# EAGLE design BE200_QUAD_Rev1 (EAGLE 6.5.0)
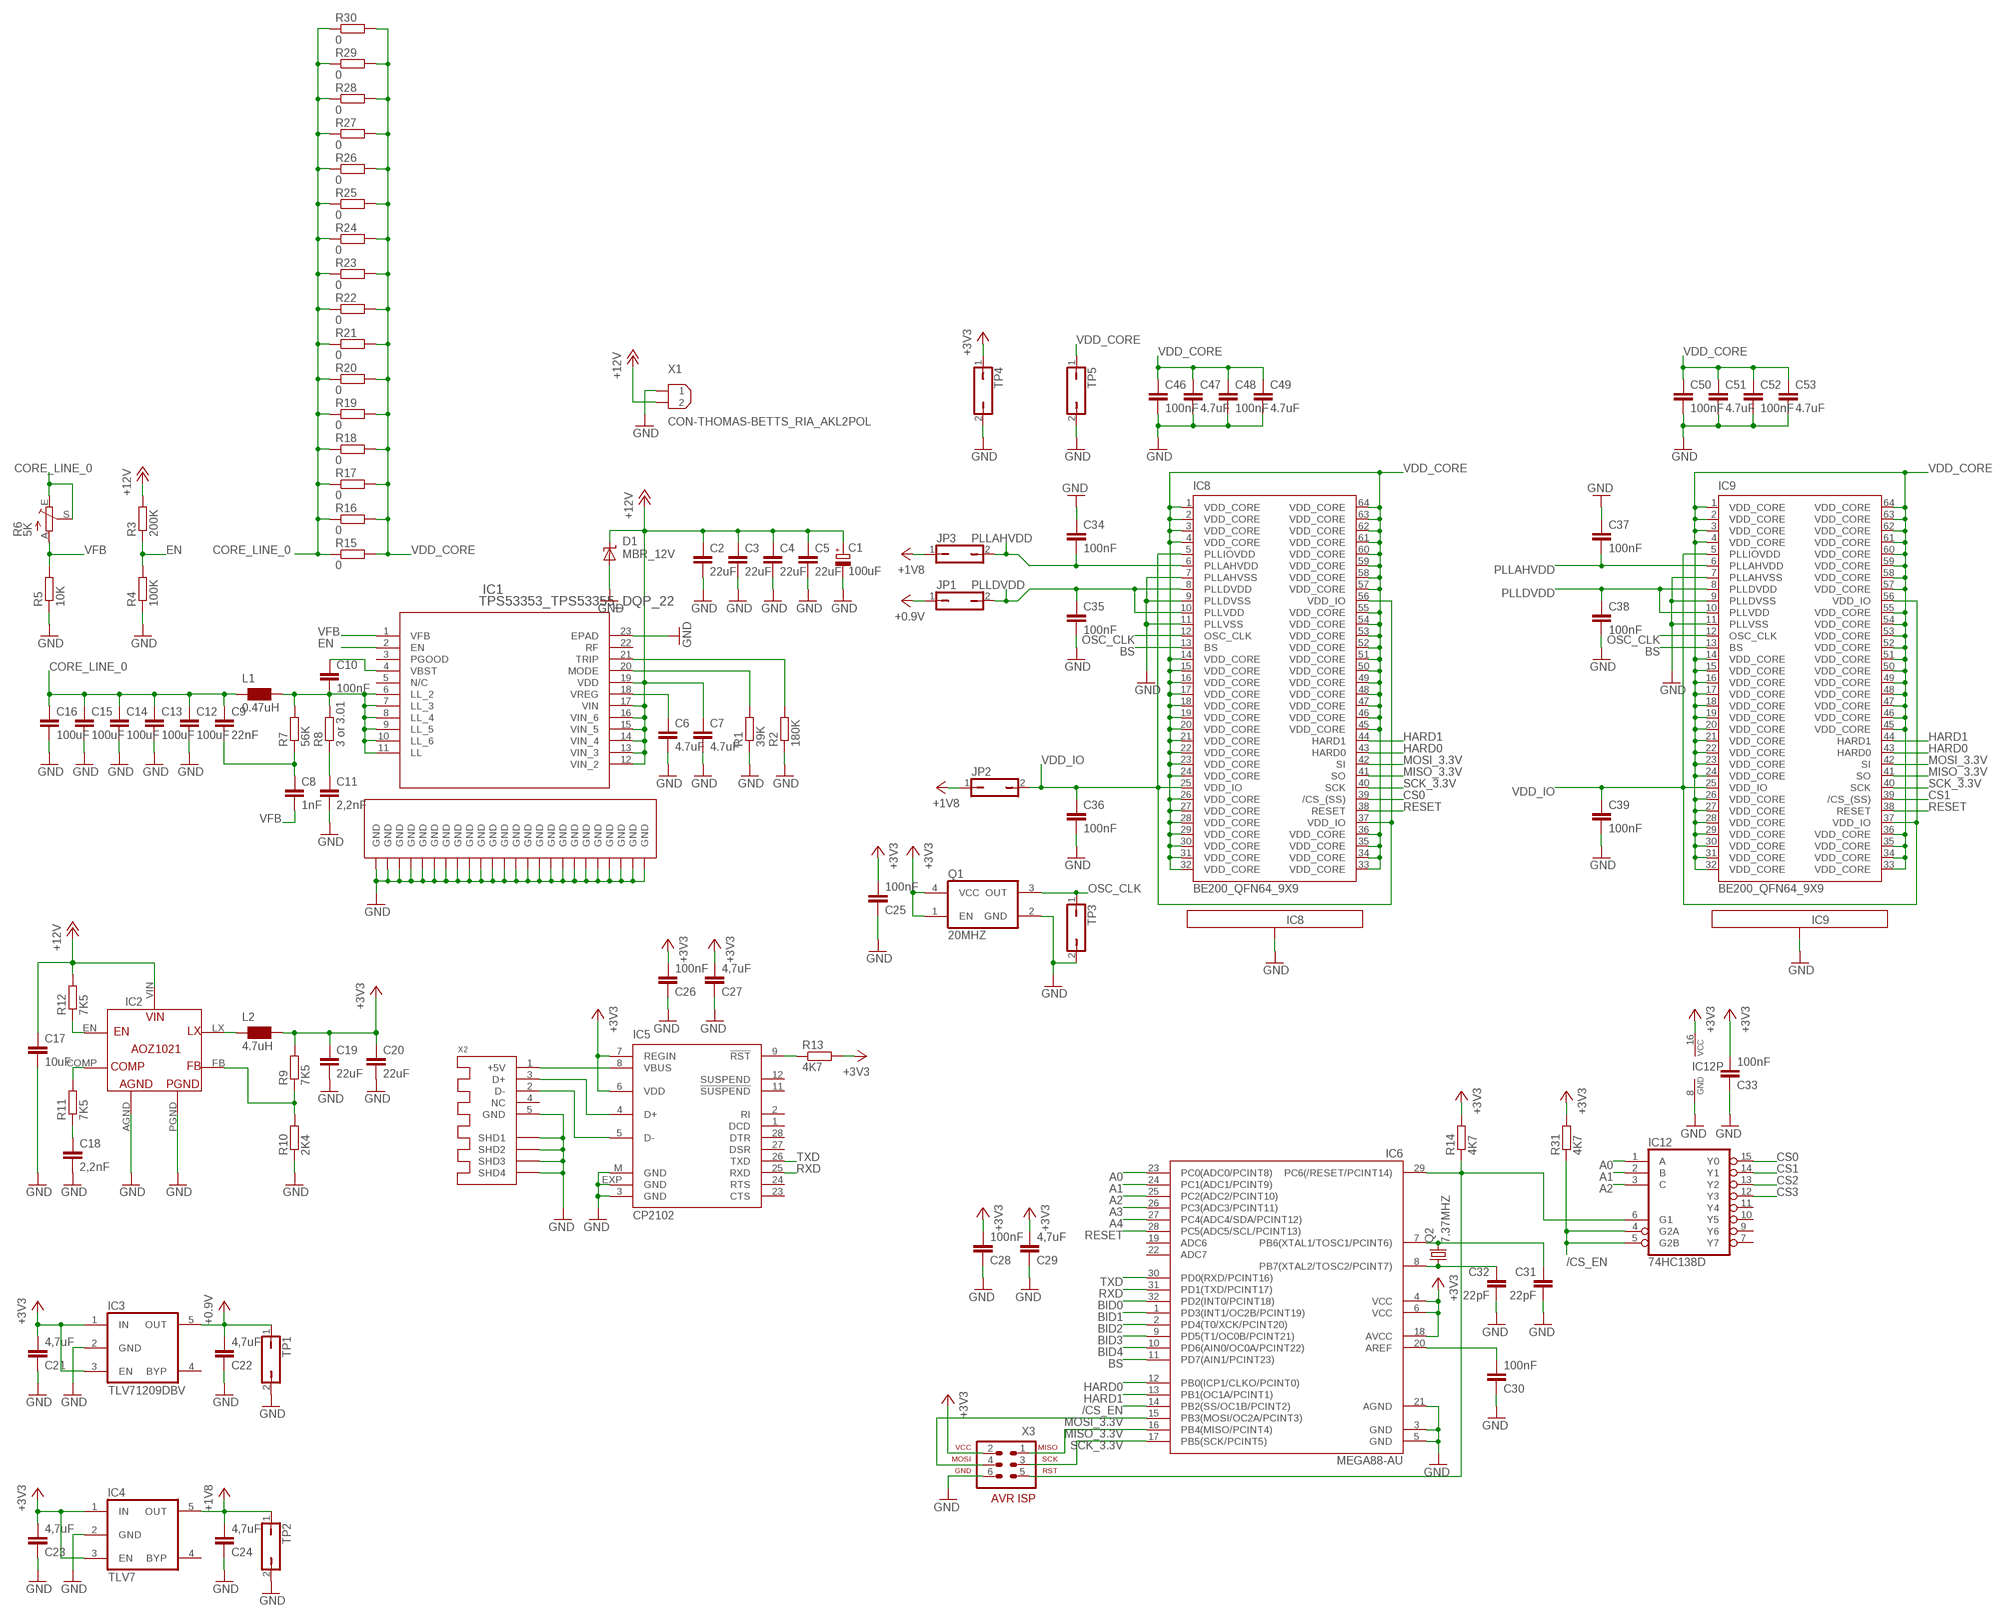
[diagram p0: schematic, sheet 1, part 1 of 2]
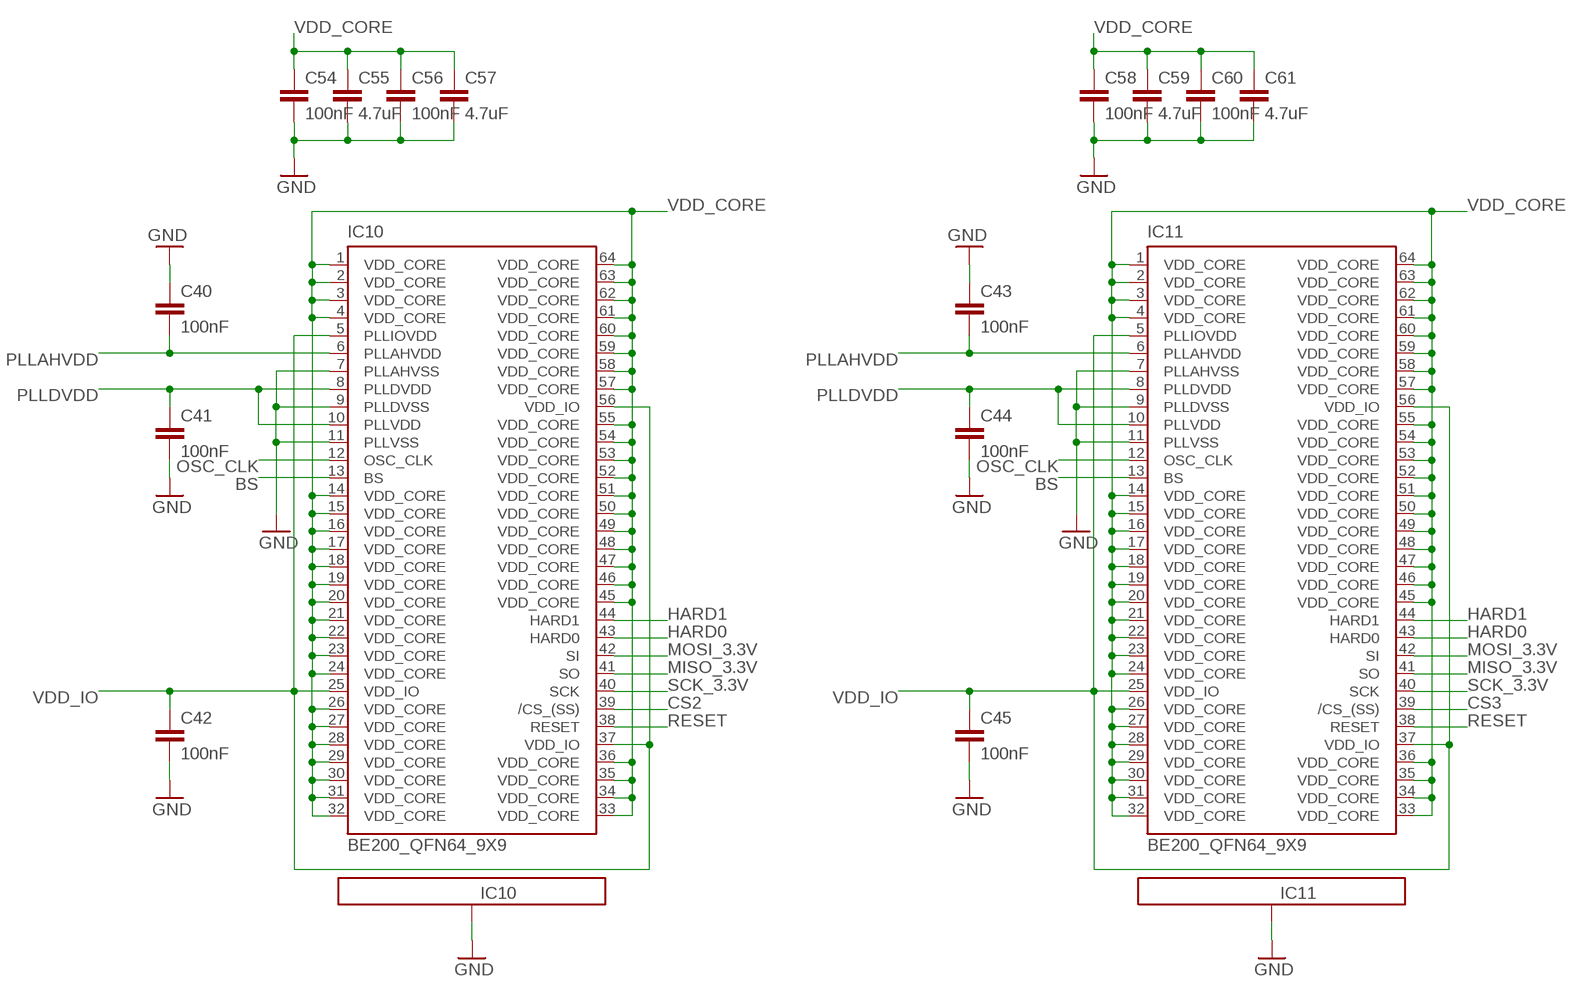
[diagram p1: schematic, sheet 1, part 2 of 2]

## Parts
C1  100uF  CPOL-EU153CLV-0605  [153CLV-0605]
C2  22uF  C-EUC1210K  [C1210K]
C3  22uF  C-EUC1210K  [C1210K]
C4  22uF  C-EUC1210K  [C1210K]
C5  22uF  C-EUC1210K  [C1210K]
C6  4.7uF  C-EUC0805K  [C0805K]
C7  4.7uF  C-EUC0805K  [C0805K]
C8  1nF  C-EUC0805K  [C0805K]
C9  22nF  C-EUC0805K  [C0805K]
C10  100nF  C-EUC0805K  [C0805K]
C11  2,2nF  C-EUC0805K  [C0805K]
C12  100uF  C-EUC1210K  [C1210K]
C13  100uF  C-EUC1210K  [C1210K]
C14  100uF  C-EUC1210K  [C1210K]
C15  100uF  C-EUC1210K  [C1210K]
C16  100uF  C-EUC1210K  [C1210K]
C17  10uF  C-EUC1206K  [C1206K]
C18  2,2nF  C-EUC0805K  [C0805K]
C19  22uF  C-EUC1206K  [C1206K]
C20  22uF  C-EUC1206K  [C1206K]
C21  4,7uF  C-EUC0805K  [C0805K]
C22  4,7uF  C-EUC0805K  [C0805K]
C23  4,7uF  C-EUC0805K  [C0805K]
C24  4,7uF  C-EUC0805K  [C0805K]
C25  100nF  C-EUC0805K  [C0805K]
C26  100nF  C-EUC0805K  [C0805K]
C27  4,7uF  C-EUC0805K  [C0805K]
C28  100nF  C-EUC0805K  [C0805K]
C29  4,7uF  C-EUC0805K  [C0805K]
C30  100nF  C-EUC0805K  [C0805K]
C31  22pF  C-EUC0805K  [C0805K]
C32  22pF  C-EUC0805K  [C0805K]
C33  100nF  C-EUC0805K  [C0805K]
C34  100nF  MYRCL_C-EUC0603K  [MYRCL_C0603K]
C35  100nF  MYRCL_C-EUC0603K  [MYRCL_C0603K]
C36  100nF  MYRCL_C-EUC0603K  [MYRCL_C0603K]
C37  100nF  MYRCL_C-EUC0603K  [MYRCL_C0603K]
C38  100nF  MYRCL_C-EUC0603K  [MYRCL_C0603K]
C39  100nF  MYRCL_C-EUC0603K  [MYRCL_C0603K]
C40  100nF  MYRCL_C-EUC0603K  [MYRCL_C0603K]
C41  100nF  MYRCL_C-EUC0603K  [MYRCL_C0603K]
C42  100nF  MYRCL_C-EUC0603K  [MYRCL_C0603K]
C43  100nF  MYRCL_C-EUC0603K  [MYRCL_C0603K]
C44  100nF  MYRCL_C-EUC0603K  [MYRCL_C0603K]
C45  100nF  MYRCL_C-EUC0603K  [MYRCL_C0603K]
C46  100nF  MYRCL_C-EUC0603K  [MYRCL_C0603K]
C47  4.7uF  MYRCL_C-EUC0603K  [MYRCL_C0603K]
C48  100nF  MYRCL_C-EUC0603K  [MYRCL_C0603K]
C49  4.7uF  MYRCL_C-EUC0603K  [MYRCL_C0603K]
C50  100nF  MYRCL_C-EUC0603K  [MYRCL_C0603K]
C51  4.7uF  MYRCL_C-EUC0603K  [MYRCL_C0603K]
C52  100nF  MYRCL_C-EUC0603K  [MYRCL_C0603K]
C53  4.7uF  MYRCL_C-EUC0603K  [MYRCL_C0603K]
C54  100nF  MYRCL_C-EUC0603K  [MYRCL_C0603K]
C55  4.7uF  MYRCL_C-EUC0603K  [MYRCL_C0603K]
C56  100nF  MYRCL_C-EUC0603K  [MYRCL_C0603K]
C57  4.7uF  MYRCL_C-EUC0603K  [MYRCL_C0603K]
C58  100nF  MYRCL_C-EUC0603K  [MYRCL_C0603K]
C59  4.7uF  MYRCL_C-EUC0603K  [MYRCL_C0603K]
C60  100nF  MYRCL_C-EUC0603K  [MYRCL_C0603K]
C61  4.7uF  MYRCL_C-EUC0603K  [MYRCL_C0603K]
D1  MBR_12V  SUPPRESSOR-SMBJ  [SMBJ]
IC1  TPS53353_TPS53355_DQP_22  TPS53355_DQP_22  [DQP22_5P479X3P24]
IC2  AOZ1021  [AOZ1021]
IC3  TLV71209DBV  VREG_5PINS-SOT-23-5  [SOT-23-5]
IC4  TLV7  VREG_5PINS-SOT-23-5  [SOT-23-5]
IC5  CP2102  SILABS2_CP2102  [SILABS2_MLP28]
IC6  MEGA88-AU  MEGA48/88/168-AU  [TQFP32-08]
IC8  BE200_QFN64_9X9  [QFN64-9X9]
IC9  BE200_QFN64_9X9  [QFN64-9X9]
IC10  BE200_QFN64_9X9  [QFN64-9X9]
IC11  BE200_QFN64_9X9  [QFN64-9X9]
IC12  74HC138D  [SO16]
JP1  JP1Q  [JP1]
JP2  JP1Q  [JP1]
JP3  JP1Q  [JP1]
L1  0.47uH  INDCUTOR_PA0513  [INDUCTOR_PA0513]
L2  4.7uH  INDUCTOR_7.3X7.3  [INDCUCTOR_7.3X7.3]
Q1  20MHZ  OSC-OSCILLATOR  [OSCILLATOR_7X5_SMD]
Q2  7.37MHZ  CRYSTALHC49UP  [HC49UP]
R1  39K  R-EU_R0805K  [R0805K]
R2  180K  R-EU_R0805K  [R0805K]
R3  200K  R-EU_R0805K  [R0805K]
R4  100K  R-EU_R0805K  [R0805K]
R5  10K  R-EU_R0805K  [R0805K]
R6  5K  TRIM_EU-S64W  [S64W]
R7  56K  R-EU_R0805K  [R0805K]
R8  3 or 3.01  R-EU_R0805K  [R0805K]
R9  7K5  R-EU_R0805K  [R0805K]
R10  2K4  R-EU_R0805K  [R0805K]
R11  7K5  R-EU_R0805K  [R0805K]
R12  7K5  R-EU_R0805K  [R0805K]
R13  4K7  R-EU_R0805K  [R0805K]
R14  4K7  R-EU_R0805K  [R0805K]
R15  0  R-EU_R0805K  [R0805K]
R16  0  R-EU_R0805K  [R0805K]
R17  0  R-EU_R0805K  [R0805K]
R18  0  R-EU_R0805K  [R0805K]
R19  0  R-EU_R0805K  [R0805K]
R20  0  R-EU_R0805K  [R0805K]
R21  0  R-EU_R0805K  [R0805K]
R22  0  R-EU_R0805K  [R0805K]
R23  0  R-EU_R0805K  [R0805K]
R24  0  R-EU_R0805K  [R0805K]
R25  0  R-EU_R0805K  [R0805K]
R26  0  R-EU_R0805K  [R0805K]
R27  0  R-EU_R0805K  [R0805K]
R28  0  R-EU_R0805K  [R0805K]
R29  0  R-EU_R0805K  [R0805K]
R30  0  R-EU_R0805K  [R0805K]
R31  4K7  R-EU_R0805K  [R0805K]
TP1  JP1Q  [JP1]
TP2  JP1Q  [JP1]
TP3  JP1Q  [JP1]
TP4  JP1Q  [JP1]
TP5  JP1Q  [JP1]
X1  CON-THOMAS-BETTS_RIA_AKL2POL  [CON-THOMAS-BETTS_RIA_AKL2POL]
X2  MYSTUFF_USB-MINI-ASSMANN  [MYSTUFF_USB_MINI-ASSMANN]
X3  AVR-ISP-6VERT  [AVR-ISP-6]

## Nets
+0.9V [xpower]: C22.2 IC3.5(OUT) JP1.1 TP1.1
+1V8 [xpower]: C24.2 IC4.5(OUT) JP2.1 JP3.1 TP2.1
+3V3 [power]: C19.1 C20.1 C21.2 C23.2 C25.2 C26.2 C27.2 C28.2 C29.2 C33.2 IC3.1(IN) IC3.3(EN) IC4.1(IN) IC4.3(EN) IC5.6(VDD) IC5.7(REGIN) IC6.4(VCC) IC6.6(VCC) IC6.18(AVCC) IC12.16(VCC) L2.2 Q1.1(EN) Q1.4(VCC) R9.2 R13.2 R14.2 R31.2 TP4.1 X3.2
+12V: C1.+ C2.1 C3.1 C4.1 C5.1 C7.1 C17.1 D1.C IC1.12(VIN_2) IC1.13(VIN_3) IC1.14(VIN_4) IC1.15(VIN_5) IC1.16(VIN_6) IC1.17(VIN) IC1.19(VDD) IC2.VIN R3.2 R12.2 X1.2
/CS_EN: IC6.14(PB2(SS/OC1B/PCINT2)) IC12.4(G2A) IC12.5(G2B) R31.1
A0: IC6.23(PC0(ADC0/PCINT8)) IC12.1(A)
A1: IC6.24(PC1(ADC1/PCINT9)) IC12.2(B)
A2: IC6.25(PC2(ADC2/PCINT10)) IC12.3(C)
A3: IC6.26(PC3(ADC3/PCINT11))
A4: IC6.27(PC4(ADC4/SDA/PCINT12))
BID0: IC6.32(PD2(INT0/PCINT18))
BID1: IC6.1(PD3(INT1/OC2B/PCINT19))
BID2: IC6.2(PD4(T0/XCK/PCINT20))
BID3: IC6.9(PD5(T1/OC0B/PCINT21))
BID4: IC6.10(PD6(AIN0/OC0A/PCINT22))
BS: IC6.11(PD7(AIN1/PCINT23)) IC8.13(BS) IC9.13(BS) IC10.13(BS) IC11.13(BS)
CORE_LINE_0 [xpower]: C9.1 C12.1 C13.1 C14.1 C15.1 C16.1 L1.1 R6.E R6.S R15.1 R16.1 R17.1 R18.1 R19.1 R20.1 R21.1 R22.1 R23.1 R24.1 R25.1 R26.1 R27.1 R28.1 R29.1 R30.1
CS0: IC8.39(/CS_(SS)) IC12.15(Y0)
CS1: IC9.39(/CS_(SS)) IC12.14(Y1)
CS2: IC10.39(/CS_(SS)) IC12.13(Y2)
CS3: IC11.39(/CS_(SS)) IC12.12(Y3)
EN: IC1.2(EN) R3.1 R4.2
GND: C1.- C2.2 C3.2 C4.2 C5.2 C6.2 C7.2 C11.2 C12.2 C13.2 C14.2 C15.2 C16.2 C17.2 C18.2 C19.2 C20.2 C21.1 C22.1 C23.1 C24.1 C25.1 C26.1 C27.1 C28.1 C29.1 C30.1 C31.2 C32.2 C33.1 C34.1 C35.2 C36.2 C37.1 C38.2 C39.2 C40.1 C41.2 C42.2 C43.1 C44.2 C45.2 C46.2 C47.2 C48.2 C49.2 C50.2 C51.2 C52.2 C53.2 C54.2 C55.2 C56.2 C57.2 C58.2 C59.2 C60.2 C61.2 D1.A IC1.23(EPAD) IC1.GND@1(GND) IC1.GND@2(GND) IC1.GND@3(GND) IC1.GND@4(GND) IC1.GND@5(GND) IC1.GND@6(GND) IC1.GND@7(GND) IC1.GND@8(GND) IC1.GND@9(GND) IC1.GND@10(GND) IC1.GND@11(GND) IC1.GND@12(GND) IC1.GND@13(GND) IC1.GND@14(GND) IC1.GND@15(GND) IC1.GND@16(GND) IC1.GND@17(GND) IC1.GND@18(GND) IC1.GND@19(GND) IC1.GND@20(GND) IC1.GND@21(GND) IC1.GND@22(GND) IC1.GND@23(GND) IC1.GND@24(GND) IC2.AGND IC2.PGND IC3.2(GND) IC4.2(GND) IC5.3(GND) IC5.EXP(GND) IC5.M(GND) IC6.3(GND) IC6.5(GND) IC6.21(AGND) IC8.7(PLLAHVSS) IC8.9(PLLDVSS) IC8.11(PLLVSS) IC8.EXP@1(GND) IC8.EXP@2(GND) IC8.EXP@3(GND) IC8.EXP@4(GND) IC8.EXP@5(GND) IC8.EXP@6(GND) IC8.EXP@7(GND) IC8.EXP@8(GND) IC8.EXP@9(GND) IC8.EXP@10(GND) IC8.EXP@11(GND) IC8.EXP@12(GND) IC8.EXP@13(GND) IC8.EXP@14(GND) IC8.EXP@15(GND) IC8.EXP@16(GND) IC8.EXP@17(GND) IC8.EXP@18(GND) IC8.EXP@19(GND) IC8.EXP@20(GND) IC8.EXP@21(GND) IC8.EXP@22(GND) IC8.EXP@23(GND) IC8.EXP@24(GND) IC8.EXP@25(GND) IC8.EXP@26(GND) IC8.EXP@27(GND) IC8.EXP@28(GND) IC8.EXP@29(GND) IC8.EXP@30(GND) IC8.EXP@31(GND) IC8.EXP@32(GND) IC8.EXP@33(GND) IC8.EXP@34(GND) IC8.EXP@35(GND) IC8.EXP@36(GND) IC8.EXP@37(GND) IC8.EXP@38(GND) IC8.EXP@39(GND) IC8.EXP@40(GND) IC8.EXP@41(GND) IC8.EXP@42(GND) IC8.EXP@43(GND) IC8.EXP@44(GND) IC8.EXP@45(GND) IC8.EXP@46(GND) IC8.EXP@47(GND) IC8.EXP@48(GND) IC8.EXP@49(GND) IC9.7(PLLAHVSS) IC9.9(PLLDVSS) IC9.11(PLLVSS) IC9.EXP@1(GND) IC9.EXP@2(GND) IC9.EXP@3(GND) IC9.EXP@4(GND) IC9.EXP@5(GND) IC9.EXP@6(GND) IC9.EXP@7(GND) IC9.EXP@8(GND) IC9.EXP@9(GND) IC9.EXP@10(GND) IC9.EXP@11(GND) IC9.EXP@12(GND) IC9.EXP@13(GND) IC9.EXP@14(GND) IC9.EXP@15(GND) IC9.EXP@16(GND) IC9.EXP@17(GND) IC9.EXP@18(GND) IC9.EXP@19(GND) IC9.EXP@20(GND) IC9.EXP@21(GND) IC9.EXP@22(GND) IC9.EXP@23(GND) IC9.EXP@24(GND) IC9.EXP@25(GND) IC9.EXP@26(GND) IC9.EXP@27(GND) IC9.EXP@28(GND) IC9.EXP@29(GND) IC9.EXP@30(GND) IC9.EXP@31(GND) IC9.EXP@32(GND) IC9.EXP@33(GND) IC9.EXP@34(GND) IC9.EXP@35(GND) IC9.EXP@36(GND) IC9.EXP@37(GND) IC9.EXP@38(GND) IC9.EXP@39(GND) IC9.EXP@40(GND) IC9.EXP@41(GND) IC9.EXP@42(GND) IC9.EXP@43(GND) IC9.EXP@44(GND) IC9.EXP@45(GND) IC9.EXP@46(GND) IC9.EXP@47(GND) IC9.EXP@48(GND) IC9.EXP@49(GND) IC10.7(PLLAHVSS) IC10.9(PLLDVSS) IC10.11(PLLVSS) IC10.EXP@1(GND) IC10.EXP@2(GND) IC10.EXP@3(GND) IC10.EXP@4(GND) IC10.EXP@5(GND) IC10.EXP@6(GND) IC10.EXP@7(GND) IC10.EXP@8(GND) IC10.EXP@9(GND) IC10.EXP@10(GND) IC10.EXP@11(GND) IC10.EXP@12(GND) IC10.EXP@13(GND) IC10.EXP@14(GND) IC10.EXP@15(GND) IC10.EXP@16(GND) IC10.EXP@17(GND) IC10.EXP@18(GND) IC10.EXP@19(GND) IC10.EXP@20(GND) IC10.EXP@21(GND) IC10.EXP@22(GND) IC10.EXP@23(GND) IC10.EXP@24(GND) IC10.EXP@25(GND) IC10.EXP@26(GND) IC10.EXP@27(GND) IC10.EXP@28(GND) IC10.EXP@29(GND) IC10.EXP@30(GND) IC10.EXP@31(GND) IC10.EXP@32(GND) IC10.EXP@33(GND) IC10.EXP@34(GND) IC10.EXP@35(GND) IC10.EXP@36(GND) IC10.EXP@37(GND) IC10.EXP@38(GND) IC10.EXP@39(GND) IC10.EXP@40(GND) IC10.EXP@41(GND) IC10.EXP@42(GND) IC10.EXP@43(GND) IC10.EXP@44(GND) IC10.EXP@45(GND) IC10.EXP@46(GND) IC10.EXP@47(GND) IC10.EXP@48(GND) IC10.EXP@49(GND) IC11.7(PLLAHVSS) IC11.9(PLLDVSS) IC11.11(PLLVSS) IC11.EXP@1(GND) IC11.EXP@2(GND) IC11.EXP@3(GND) IC11.EXP@4(GND) IC11.EXP@5(GND) IC11.EXP@6(GND) IC11.EXP@7(GND) IC11.EXP@8(GND) IC11.EXP@9(GND) IC11.EXP@10(GND) IC11.EXP@11(GND) IC11.EXP@12(GND) IC11.EXP@13(GND) IC11.EXP@14(GND) IC11.EXP@15(GND) IC11.EXP@16(GND) IC11.EXP@17(GND) IC11.EXP@18(GND) IC11.EXP@19(GND) IC11.EXP@20(GND) IC11.EXP@21(GND) IC11.EXP@22(GND) IC11.EXP@23(GND) IC11.EXP@24(GND) IC11.EXP@25(GND) IC11.EXP@26(GND) IC11.EXP@27(GND) IC11.EXP@28(GND) IC11.EXP@29(GND) IC11.EXP@30(GND) IC11.EXP@31(GND) IC11.EXP@32(GND) IC11.EXP@33(GND) IC11.EXP@34(GND) IC11.EXP@35(GND) IC11.EXP@36(GND) IC11.EXP@37(GND) IC11.EXP@38(GND) IC11.EXP@39(GND) IC11.EXP@40(GND) IC11.EXP@41(GND) IC11.EXP@42(GND) IC11.EXP@43(GND) IC11.EXP@44(GND) IC11.EXP@45(GND) IC11.EXP@46(GND) IC11.EXP@47(GND) IC11.EXP@48(GND) IC11.EXP@49(GND) IC12.8(GND) Q1.2(GND) R1.1 R2.1 R4.1 R5.1 R10.1 TP1.2 TP2.2 TP3.2 TP4.2 TP5.2 X1.1 X2.5(GND) X2.SHD1 X2.SHD2 X2.SHD3 X2.SHD4 X3.6
HARD0: IC6.12(PB0(ICP1/CLKO/PCINT0)) IC8.43(HARD0) IC9.43(HARD0) IC10.43(HARD0) IC11.43(HARD0)
HARD1: IC6.13(PB1(OC1A/PCINT1)) IC8.44(HARD1) IC9.44(HARD1) IC10.44(HARD1) IC11.44(HARD1)
MISO_3.3V: IC6.16(PB4(MISO/PCINT4)) IC8.41(SO) IC9.41(SO) IC10.41(SO) IC11.41(SO) X3.1
MOSI_3.3V: IC6.15(PB3(MOSI/OC2A/PCINT3)) IC8.42(SI) IC9.42(SI) IC10.42(SI) IC11.42(SI) X3.4
N$1: C10.2 IC1.6(LL_2) IC1.7(LL_3) IC1.8(LL_4) IC1.9(LL_5) IC1.10(LL_6) IC1.11(LL) L1.2 R7.2 R8.2
N$3: C11.1 R8.1
N$4: C8.1 C9.2 R7.1
N$6: IC6.29(PC6(/RESET/PCINT14)) IC12.6(G1) R14.1 X3.5
N$8: IC1.21(TRIP) R2.2
N$9: IC1.20(MODE) R1.2
N$10: C6.1 IC1.18(VREG)
N$14: C10.1 IC1.4(VBST)
N$18: C18.1 R11.1
N$21: IC2.LX L2.1
N$23: IC2.FB R9.1 R10.2
N$24: IC2.COMP R11.2
N$25: IC2.EN R12.1
N$26: C30.2 IC6.20(AREF)
N$30: C31.1 IC6.7(PB6(XTAL1/TOSC1/PCINT6)) Q2.2
N$32: IC5.9(!RST) R13.1
N$34: C32.1 IC6.8(PB7(XTAL2/TOSC2/PCINT7)) Q2.1
N$35: IC5.4(D+) X2.3(D+)
N$36: IC5.5(D-) X2.2(D-)
N$38: IC5.8(VBUS) X2.1(+5V)
OSC_CLK: IC8.12(OSC_CLK) IC9.12(OSC_CLK) IC10.12(OSC_CLK) IC11.12(OSC_CLK) Q1.3(OUT) TP3.1
PLLAHVDD [xpower]: C34.2 C37.2 C40.2 C43.2 IC8.6(PLLAHVDD) IC9.6(PLLAHVDD) IC10.6(PLLAHVDD) IC11.6(PLLAHVDD) JP3.2
PLLDVDD [xpower]: C35.1 C38.1 C41.1 C44.1 IC8.8(PLLDVDD) IC8.10(PLLVDD) IC9.8(PLLDVDD) IC9.10(PLLVDD) IC10.8(PLLDVDD) IC10.10(PLLVDD) IC11.8(PLLDVDD) IC11.10(PLLVDD) JP1.2
RESET: IC6.28(PC5(ADC5/SCL/PCINT13)) IC8.38(RESET) IC9.38(RESET) IC10.38(RESET) IC11.38(RESET)
RXD: IC5.25(RXD) IC6.31(PD1(TXD/PCINT17))
SCK_3.3V: IC6.17(PB5(SCK/PCINT5)) IC8.40(SCK) IC9.40(SCK) IC10.40(SCK) IC11.40(SCK) X3.3
TXD: IC5.26(TXD) IC6.30(PD0(RXD/PCINT16))
VDD_CORE: C46.1 C47.1 C48.1 C49.1 C50.1 C51.1 C52.1 C53.1 C54.1 C55.1 C56.1 C57.1 C58.1 C59.1 C60.1 C61.1 IC8.1(VDD_CORE) IC8.2(VDD_CORE) IC8.3(VDD_CORE) IC8.4(VDD_CORE) IC8.14(VDD_CORE) IC8.15(VDD_CORE) IC8.16(VDD_CORE) IC8.17(VDD_CORE) IC8.18(VDD_CORE) IC8.19(VDD_CORE) IC8.20(VDD_CORE) IC8.21(VDD_CORE) IC8.22(VDD_CORE) IC8.23(VDD_CORE) IC8.24(VDD_CORE) IC8.26(VDD_CORE) IC8.27(VDD_CORE) IC8.28(VDD_CORE) IC8.29(VDD_CORE) IC8.30(VDD_CORE) IC8.31(VDD_CORE) IC8.32(VDD_CORE) IC8.33(VDD_CORE) IC8.34(VDD_CORE) IC8.35(VDD_CORE) IC8.36(VDD_CORE) IC8.45(VDD_CORE) IC8.46(VDD_CORE) IC8.47(VDD_CORE) IC8.48(VDD_CORE) IC8.49(VDD_CORE) IC8.50(VDD_CORE) IC8.51(VDD_CORE) IC8.52(VDD_CORE) IC8.53(VDD_CORE) IC8.54(VDD_CORE) IC8.55(VDD_CORE) IC8.57(VDD_CORE) IC8.58(VDD_CORE) IC8.59(VDD_CORE) IC8.60(VDD_CORE) IC8.61(VDD_CORE) IC8.62(VDD_CORE) IC8.63(VDD_CORE) IC8.64(VDD_CORE) IC9.1(VDD_CORE) IC9.2(VDD_CORE) IC9.3(VDD_CORE) IC9.4(VDD_CORE) IC9.14(VDD_CORE) IC9.15(VDD_CORE) IC9.16(VDD_CORE) IC9.17(VDD_CORE) IC9.18(VDD_CORE) IC9.19(VDD_CORE) IC9.20(VDD_CORE) IC9.21(VDD_CORE) IC9.22(VDD_CORE) IC9.23(VDD_CORE) IC9.24(VDD_CORE) IC9.26(VDD_CORE) IC9.27(VDD_CORE) IC9.28(VDD_CORE) IC9.29(VDD_CORE) IC9.30(VDD_CORE) IC9.31(VDD_CORE) IC9.32(VDD_CORE) IC9.33(VDD_CORE) IC9.34(VDD_CORE) IC9.35(VDD_CORE) IC9.36(VDD_CORE) IC9.45(VDD_CORE) IC9.46(VDD_CORE) IC9.47(VDD_CORE) IC9.48(VDD_CORE) IC9.49(VDD_CORE) IC9.50(VDD_CORE) IC9.51(VDD_CORE) IC9.52(VDD_CORE) IC9.53(VDD_CORE) IC9.54(VDD_CORE) IC9.55(VDD_CORE) IC9.57(VDD_CORE) IC9.58(VDD_CORE) IC9.59(VDD_CORE) IC9.60(VDD_CORE) IC9.61(VDD_CORE) IC9.62(VDD_CORE) IC9.63(VDD_CORE) IC9.64(VDD_CORE) IC10.1(VDD_CORE) IC10.2(VDD_CORE) IC10.3(VDD_CORE) IC10.4(VDD_CORE) IC10.14(VDD_CORE) IC10.15(VDD_CORE) IC10.16(VDD_CORE) IC10.17(VDD_CORE) IC10.18(VDD_CORE) IC10.19(VDD_CORE) IC10.20(VDD_CORE) IC10.21(VDD_CORE) IC10.22(VDD_CORE) IC10.23(VDD_CORE) IC10.24(VDD_CORE) IC10.26(VDD_CORE) IC10.27(VDD_CORE) IC10.28(VDD_CORE) IC10.29(VDD_CORE) IC10.30(VDD_CORE) IC10.31(VDD_CORE) IC10.32(VDD_CORE) IC10.33(VDD_CORE) IC10.34(VDD_CORE) IC10.35(VDD_CORE) IC10.36(VDD_CORE) IC10.45(VDD_CORE) IC10.46(VDD_CORE) IC10.47(VDD_CORE) IC10.48(VDD_CORE) IC10.49(VDD_CORE) IC10.50(VDD_CORE) IC10.51(VDD_CORE) IC10.52(VDD_CORE) IC10.53(VDD_CORE) IC10.54(VDD_CORE) IC10.55(VDD_CORE) IC10.57(VDD_CORE) IC10.58(VDD_CORE) IC10.59(VDD_CORE) IC10.60(VDD_CORE) IC10.61(VDD_CORE) IC10.62(VDD_CORE) IC10.63(VDD_CORE) IC10.64(VDD_CORE) IC11.1(VDD_CORE) IC11.2(VDD_CORE) IC11.3(VDD_CORE) IC11.4(VDD_CORE) IC11.14(VDD_CORE) IC11.15(VDD_CORE) IC11.16(VDD_CORE) IC11.17(VDD_CORE) IC11.18(VDD_CORE) IC11.19(VDD_CORE) IC11.20(VDD_CORE) IC11.21(VDD_CORE) IC11.22(VDD_CORE) IC11.23(VDD_CORE) IC11.24(VDD_CORE) IC11.26(VDD_CORE) IC11.27(VDD_CORE) IC11.28(VDD_CORE) IC11.29(VDD_CORE) IC11.30(VDD_CORE) IC11.31(VDD_CORE) IC11.32(VDD_CORE) IC11.33(VDD_CORE) IC11.34(VDD_CORE) IC11.35(VDD_CORE) IC11.36(VDD_CORE) IC11.45(VDD_CORE) IC11.46(VDD_CORE) IC11.47(VDD_CORE) IC11.48(VDD_CORE) IC11.49(VDD_CORE) IC11.50(VDD_CORE) IC11.51(VDD_CORE) IC11.52(VDD_CORE) IC11.53(VDD_CORE) IC11.54(VDD_CORE) IC11.55(VDD_CORE) IC11.57(VDD_CORE) IC11.58(VDD_CORE) IC11.59(VDD_CORE) IC11.60(VDD_CORE) IC11.61(VDD_CORE) IC11.62(VDD_CORE) IC11.63(VDD_CORE) IC11.64(VDD_CORE) R15.2 R16.2 R17.2 R18.2 R19.2 R20.2 R21.2 R22.2 R23.2 R24.2 R25.2 R26.2 R27.2 R28.2 R29.2 R30.2 TP5.1
VDD_IO [xpower]: C36.1 C39.1 C42.1 C45.1 IC8.5(PLLIOVDD) IC8.25(VDD_IO) IC8.37(VDD_IO) IC8.56(VDD_IO) IC9.5(PLLIOVDD) IC9.25(VDD_IO) IC9.37(VDD_IO) IC9.56(VDD_IO) IC10.5(PLLIOVDD) IC10.25(VDD_IO) IC10.37(VDD_IO) IC10.56(VDD_IO) IC11.5(PLLIOVDD) IC11.25(VDD_IO) IC11.37(VDD_IO) IC11.56(VDD_IO) JP2.2
VFB: C8.2 IC1.1(VFB) R5.2 R6.A
Unconnected: IC1.3(PGOOD) IC1.5(N/C) IC1.22(RF) IC3.4(BYP) IC4.4(BYP) IC5.1(DCD) IC5.2(RI) IC5.11(!SUSPEND) IC5.12(SUSPEND) IC5.23(CTS) IC5.24(RTS) IC5.27(DSR) IC5.28(DTR) IC6.19(ADC6) IC6.22(ADC7) IC12.7(Y7) IC12.9(Y6) IC12.10(Y5) IC12.11(Y4) X2.4(NC)

## Library data of the parts
C1 = myrcl:CPOL-EU: POLARIZED CAPACITOR, European symbol
C2-C33 = myrcl:C-EU: CAPACITOR, European symbol
C34-C61 = AM_MBE16_Rev3.10:MYRCL_C-EU: CAPACITOR, European symbol
D1 = diode:SUPPRESSOR-: Suppressor diode
IC1 = TI_DCDC2:TPS53355_DQP_22; DATASHEETURL: http://www.ti.com/lit/gpn/TPS53355; DESCRIPTION: High-Efficiency 30-A Synchronous Buck Converter in PowerStack? Package; FAMILY_NAME: STEP-DOWN REGULATOR; GENERIC_PART_NUMBER: TPS53355; INDUSTRY_STD_PKG_TYPE: SON; MANUFACTURER: Texas Instruments; MANUFACTURER_PART_NUMBER: tps53355_dqp_22; PACKAGE_DESIGNATOR: DQP; PIN_COUNT: 22; VENDOR: Texas Instruments
IC2 = mystuff:AOZ1021
IC3 IC4 = dp_devices:VREG_5PINS: 5 pins voltage regulator
IC5 = BE200:SILABS2_CP210*: Single-Chip USB to UART Bridge Source: www.silabs.com .. CP2101.pdf / cp2102.pdf
IC6 = BE200:MEGA48/88/168
IC8-IC11 = BE200:BE200_QFN64_9X9
IC12 = 74xx-eu:74*138: 3-line to 8-line DECODER/DEMULTIPLEXER
JP1-JP3 TP1-TP5 = jumper:JP1Q: JUMPER
L1 = wuerth-elektronik:INDCUTOR_PA0513
L2 = wuerth-elektronik:INDUCTOR_7.3X7.3
Q1 = dp_devices:OSC-OSCILLATOR: Oscillator
Q2 = crystal:CRYSTAL: CRYSTAL; OC_FARNELL: unknown; OC_NEWARK: unknown
R1-R5 R7-R31 = myrcl:R-EU_: RESISTOR, European symbol
R6 = pot:TRIM_EU-: POTENTIOMETER
X1 = BE200:CON-THOMAS-BETTS_RIA_AKL2POL
X2 = BE200:MYSTUFF_USB-MINI-ASSMANN
X3 = BE200:AVR-ISP-6: AVR ISP-6 Serial Programming Header

## Board
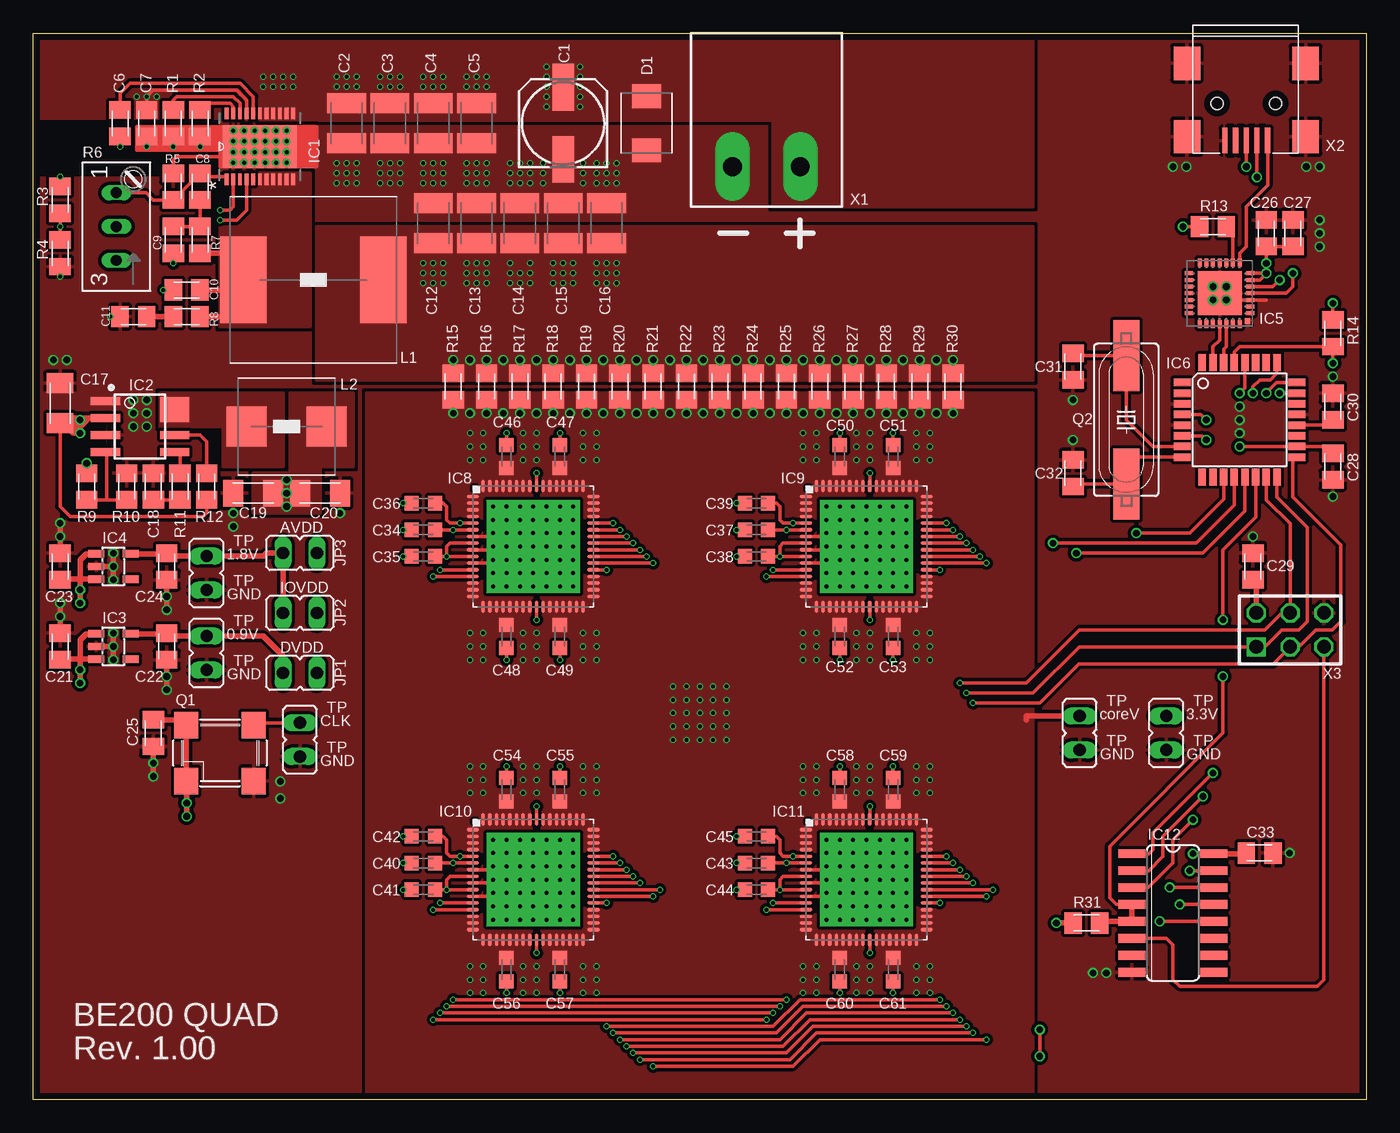
[diagram p2: board, top side]
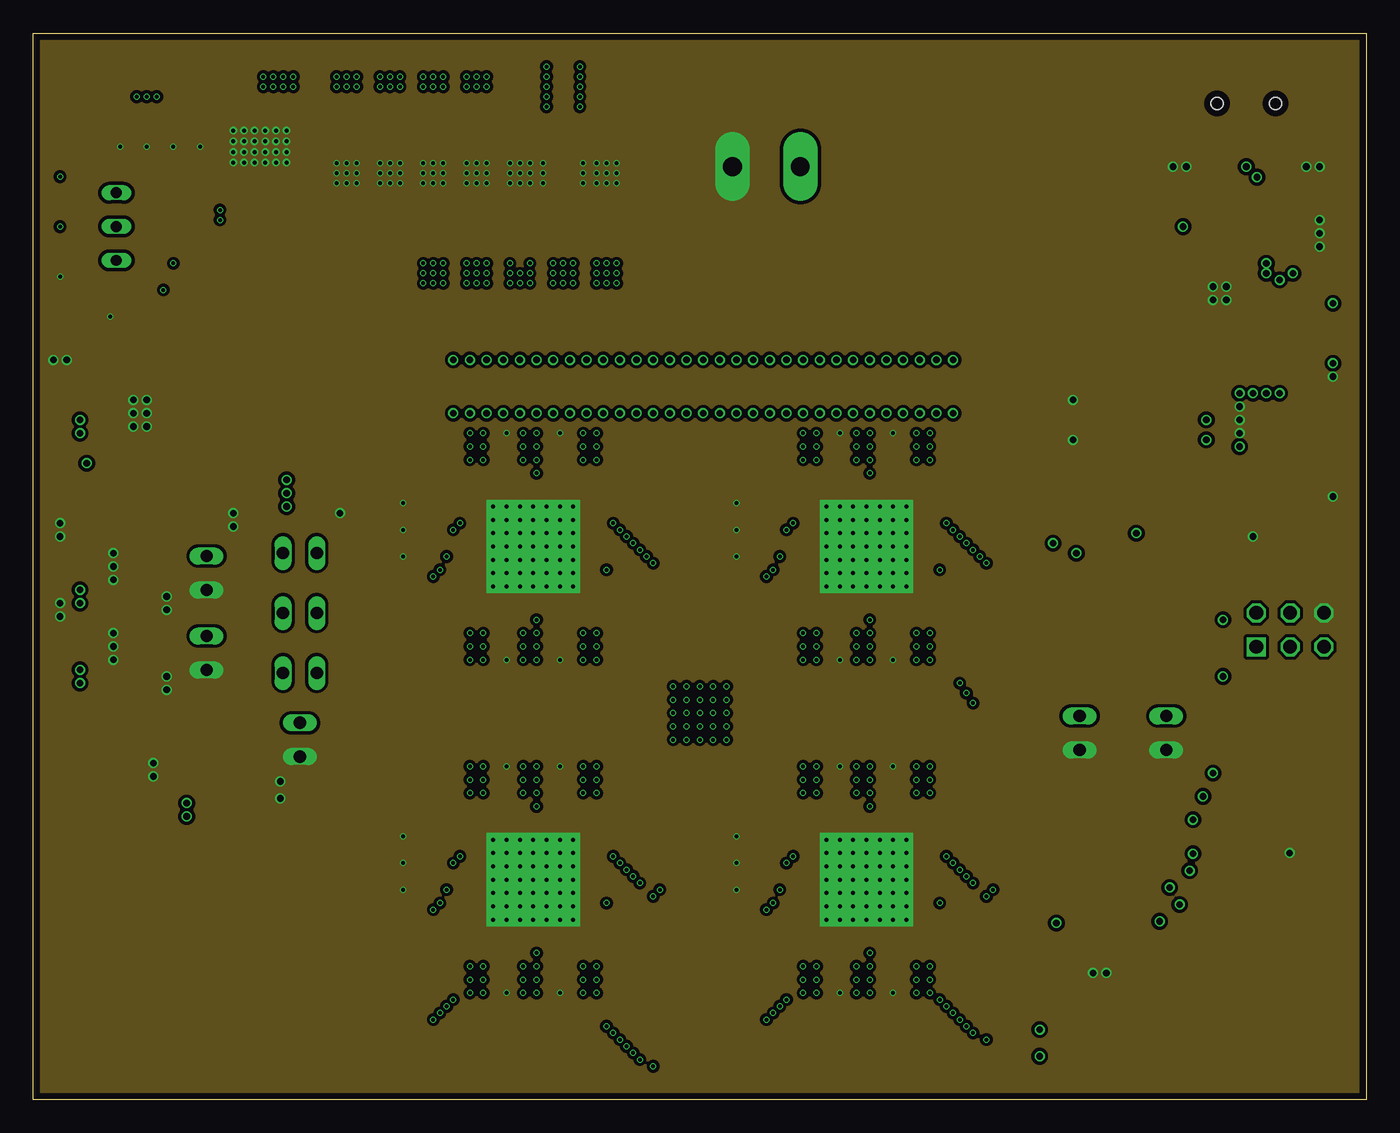
[diagram p3: board, inner layer Route2]
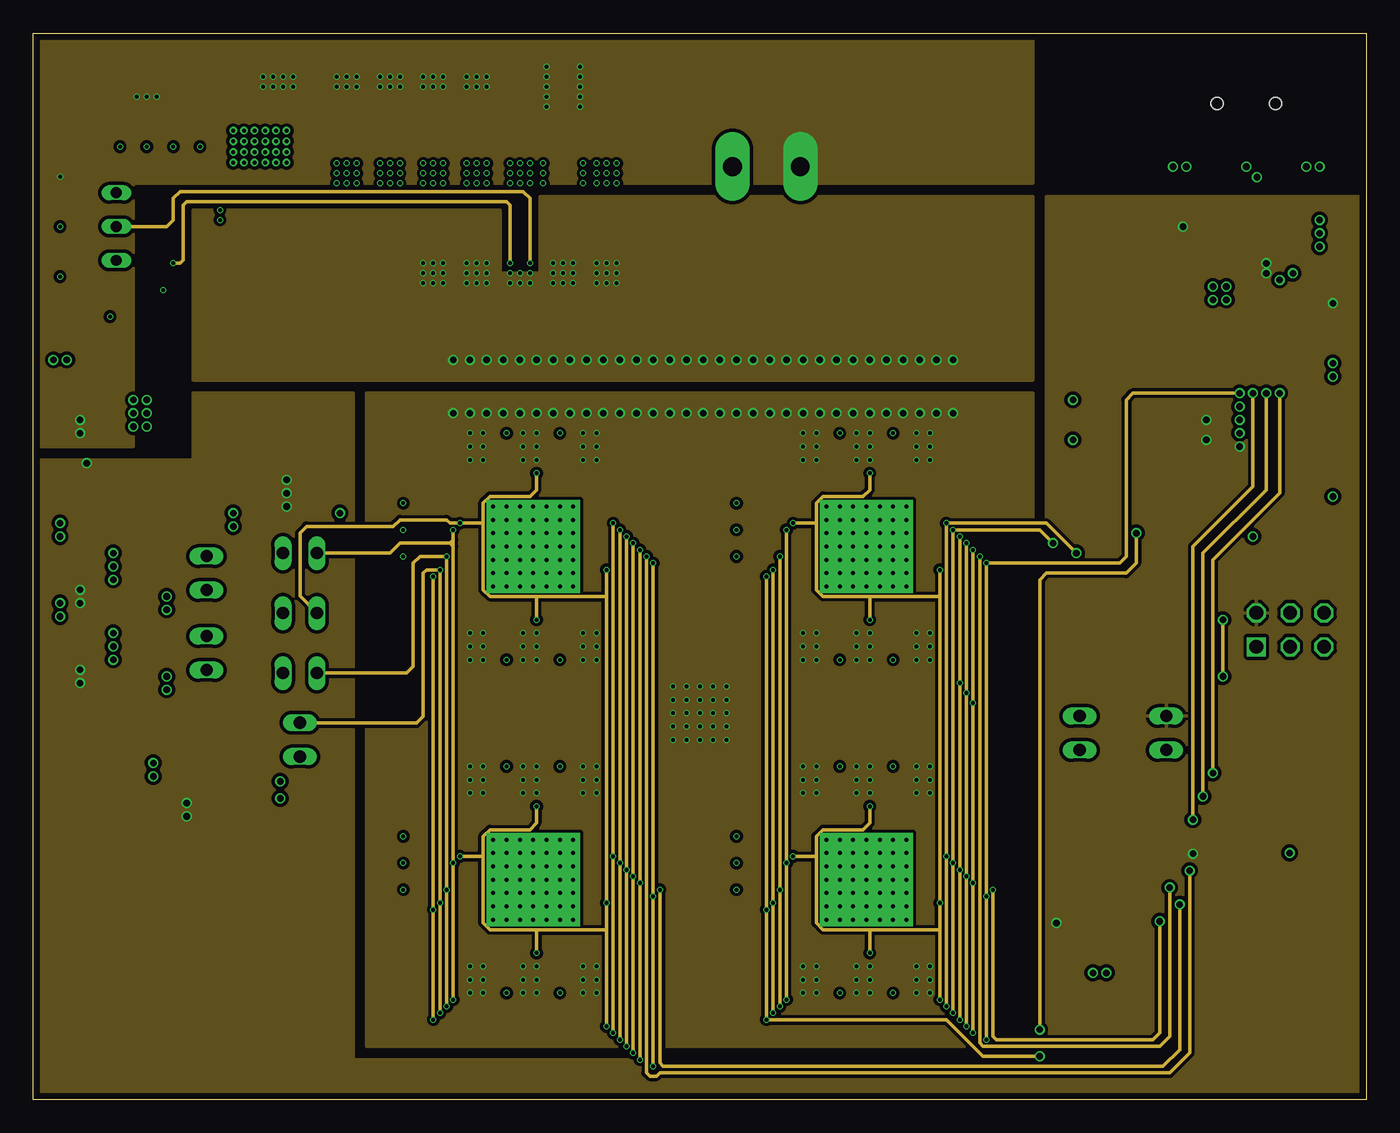
[diagram p4: board, inner layer Route15]
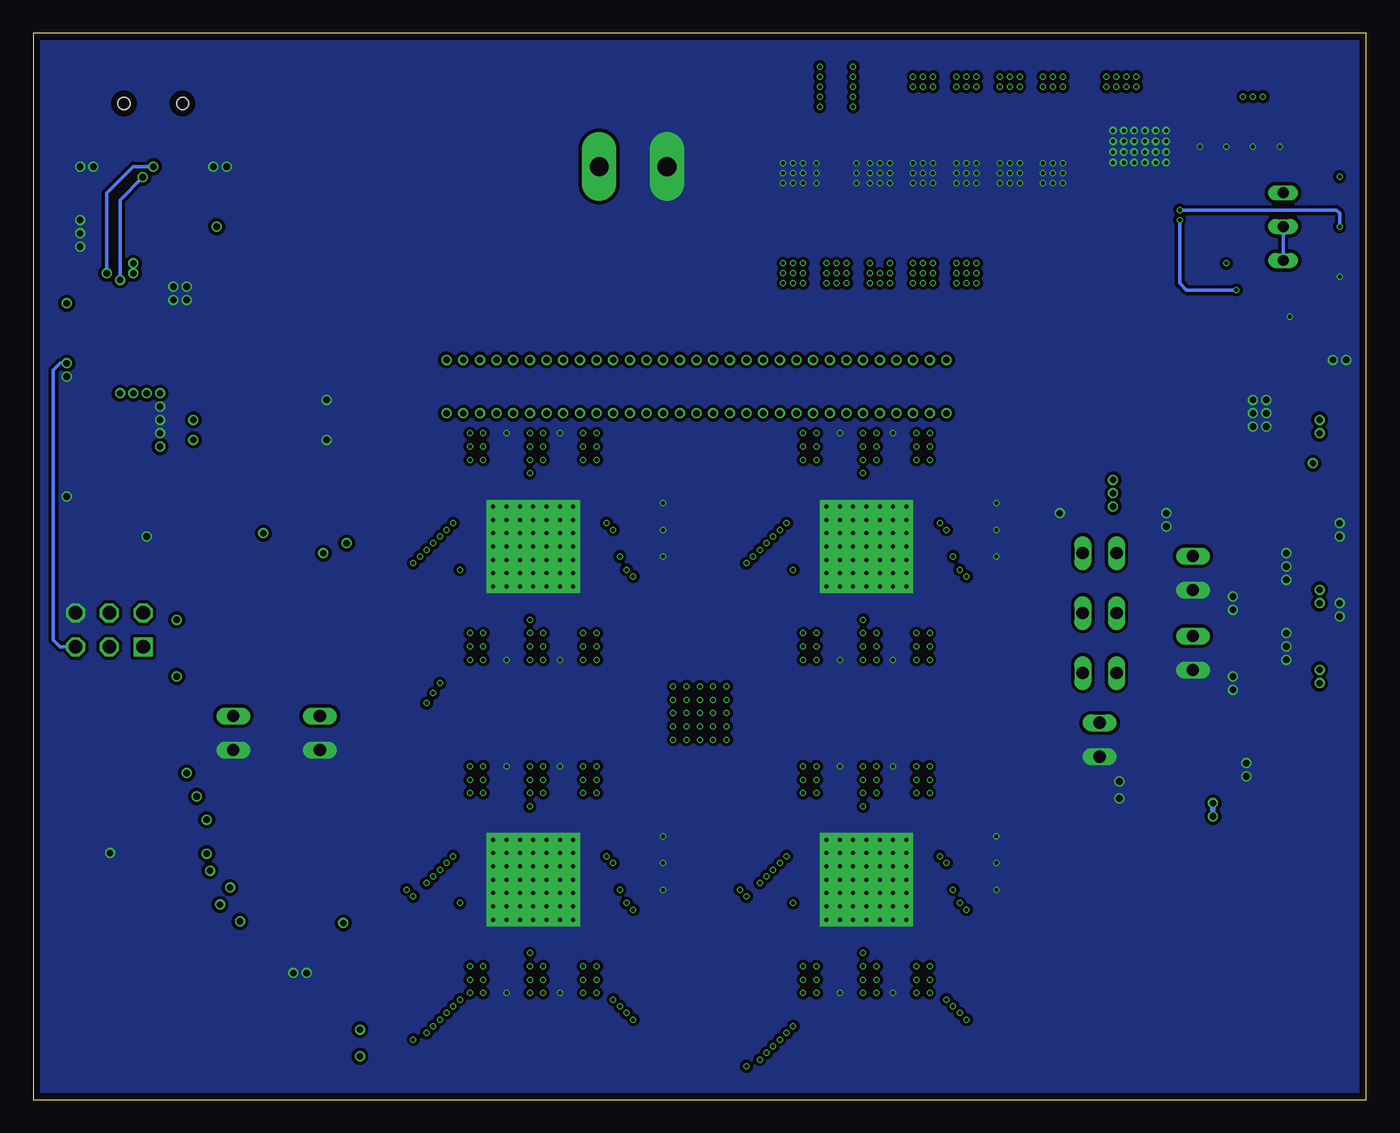
[diagram p5: board, bottom side, seen from below]

Size 100 x 80 mm. Coordinates in mm from the lower left corner, seen from the top.
Outline: 100,80 100,0 0,0 0,80 100,80
Copper layers (1*2*15*16): Top 0.035mm / dielectric 0.5mm / Route2 0.035mm / dielectric 0.5mm / Route15 0.035mm / dielectric 0.5mm / Bottom 0.035mm
Design rules "default *": minimum track width 8mil, minimum drill 0.3mm, track to track 5mil, track to pad 5mil, pad to pad 5mil, via to via 5mil, smd to smd 4mil, copper to edge 20mil, drill to drill 8mil, minimum pad ring 5mil, minimum via ring 0mil, stop-mask expansion 4mil, vias tented up to drill 30mil, thermal gap 10mil
tRestrict: area 2.2,43.8 to 5.2,50.8; area 0,69.5 to 13.8,73.2

### Footprints (pad centres in the part's own frame; a part is rotated, then mirrored left to right if it is on the bottom)
153CLV-0605 = smd 3.5 x 1.6: + 2.7,0; - -2.7,0
C1210K = smd 1.5 x 2.9: 1 -1.5,0; 2 1.5,0
C0805K = smd 1.3 x 1.6: 1 -1,0; 2 1,0
C1206K = smd 1.5 x 2: 1 -1.5,0; 2 1.5,0
MYRCL_C0603K = smd 1.05 x 1.08: 1 -0.875,0; 2 0.875,0
SMBJ = smd 1.78 x 2.16: A 2.04,0; C -2.03,0
DQP22_5P479X3P24 = smd 0.85 x 0.28: 1 -2.475,2.5; 2 -2.475,2; 3 -2.475,1.5; 4 -2.475,1; 5 -2.475,0.5; 6 -2.475,0; 7 -2.475,-0.5; 8 -2.475,-1; 9 -2.475,-1.5; 10 -2.475,-2; 11 -2.475,-2.5; 12 2.475,-2.5; 13 2.475,-2; 14 2.475,-1.5; 15 2.475,-1; 16 2.475,-0.5; 17 2.475,0; 18 2.475,0.5; 19 2.475,1; 20 2.475,1.5; 21 2.475,2; 22 2.475,2.5 | smd 3.24 x 5.48: 23 0,0 | drill 0.3: GND@1 -1.2,2; GND@2 -0.4,2; GND@3 0.4,2; GND@4 1.2,2; GND@5 -1.2,1.2; GND@6 -0.4,1.2; GND@7 0.4,1.2; GND@8 1.2,1.2; GND@9 -1.2,0.406; GND@10 -0.4,0.4; GND@11 0.4,0.4; GND@12 1.2,0.406; GND@13 -1.2,-0.406; GND@14 -0.4,-0.4; GND@15 0.4,-0.4; GND@16 1.2,-0.406; GND@17 -1.2,-1.2; GND@18 -0.4,-1.2; GND@19 0.4,-1.2; GND@20 1.2,-1.2; GND@21 -1.2,-2; GND@22 -0.4,-2; GND@23 0.4,-2; GND@24 1.2,-2
AOZ1021 = smd 0.6 x 2.2: AGND 0.635,-2.6; COMP 1.905,2.6; EN 0.635,2.6; FB 1.905,-2.6; PGND -1.905,-2.6; VIN -0.635,-2.6 | smd 1.87 x 2.2: LX -1.27,2.6
SOT-23-5 = smd 0.55 x 1.2: 1 -0.95,-1.3; 2 0,-1.3; 3 0.95,-1.3; 4 0.95,1.3; 5 -0.95,1.3
SILABS2_MLP28 = smd 0.6 x 0.3: 1 -2.3,1.5; 2 -2.3,1; 3 -2.3,0.5; 4 -2.3,0; 5 -2.3,-0.5; 6 -2.3,-1; 7 -2.3,-1.5; 15 2.3,-1.5; 16 2.3,-1; 17 2.3,-0.5; 18 2.3,0; 19 2.3,0.5; 20 2.3,1; 21 2.3,1.5 | smd 0.3 x 0.6: 8 -1.5,-2.3; 9 -1,-2.3; 10 -0.5,-2.3; 11 0,-2.3; 12 0.5,-2.3; 13 1,-2.3; 14 1.5,-2.3; 22 1.5,2.3; 23 1,2.3; 24 0.5,2.3; 25 0,2.3; 26 -0.5,2.3; 27 -1,2.3; 28 -1.5,2.3 | smd 3.3 x 3.3: EXP 0,0 | smd 0.435 x 0.435: M -2.103,2.103
TQFP32-08 = smd 1.27 x 0.559: 1 -4.293,2.8; 2 -4.293,2; 3 -4.293,1.2; 4 -4.293,0.4; 5 -4.293,-0.4; 6 -4.293,-1.2; 7 -4.293,-2; 8 -4.293,-2.8; 17 4.293,-2.8; 18 4.293,-2; 19 4.293,-1.2; 20 4.293,-0.4; 21 4.293,0.4; 22 4.293,1.2; 23 4.293,2; 24 4.293,2.8 | smd 0.559 x 1.27: 9 -2.8,-4.293; 10 -2,-4.293; 11 -1.2,-4.293; 12 -0.4,-4.293; 13 0.4,-4.293; 14 1.2,-4.293; 15 2,-4.293; 16 2.8,-4.293; 25 2.8,4.293; 26 2,4.293; 27 1.2,4.293; 28 0.4,4.293; 29 -0.4,4.293; 30 -1.2,4.293; 31 -2,4.293; 32 -2.8,4.293
QFN64-9X9 = smd 0.95 x 0.28: 1 -4.525,3.75; 2 -4.525,3.25; 3 -4.525,2.75; 4 -4.525,2.25; 5 -4.525,1.75; 6 -4.525,1.25; 7 -4.525,0.75; 8 -4.525,0.25; 9 -4.525,-0.25; 10 -4.525,-0.75; 11 -4.525,-1.25; 12 -4.525,-1.75; 13 -4.525,-2.25; 14 -4.525,-2.75; 15 -4.525,-3.25; 16 -4.525,-3.75; 33 4.525,-3.75; 34 4.525,-3.25; 35 4.525,-2.75; 36 4.525,-2.25; 37 4.525,-1.75; 38 4.525,-1.25; 39 4.525,-0.75; 40 4.525,-0.25; 41 4.525,0.25; 42 4.525,0.75; 43 4.525,1.25; 44 4.525,1.75; 45 4.525,2.25; 46 4.525,2.75; 47 4.525,3.25; 48 4.525,3.75 | smd 0.28 x 0.95: 17 -3.75,-4.525; 18 -3.25,-4.525; 19 -2.75,-4.525; 20 -2.25,-4.525; 21 -1.75,-4.525; 22 -1.25,-4.525; 23 -0.75,-4.525; 24 -0.25,-4.525; 25 0.25,-4.525; 26 0.75,-4.525; 27 1.25,-4.525; 28 1.75,-4.525; 29 2.25,-4.525; 30 2.75,-4.525; 31 3.25,-4.525; 32 3.75,-4.525; 49 3.75,4.525; 50 3.25,4.525; 51 2.75,4.525; 52 2.25,4.525; 53 1.75,4.525; 54 1.25,4.525; 55 0.75,4.525; 56 0.25,4.525; 57 -0.25,4.525; 58 -0.75,4.525; 59 -1.25,4.525; 60 -1.75,4.525; 61 -2.25,4.525; 62 -2.75,4.525; 63 -3.25,4.525; 64 -3.75,4.525 | drill 0.3 pad 1 square: EXP@1 -3,3; EXP@2 -2,3; EXP@3 -1,3; EXP@4 0,3; EXP@5 1,3; EXP@6 2,3; EXP@7 3,3; EXP@8 -3,2; EXP@9 -2,2; EXP@10 -1,2; EXP@11 0,2; EXP@12 1,2; EXP@13 2,2; EXP@14 3,2; EXP@15 -3,1; EXP@16 -2,1; EXP@17 -1,1; EXP@18 0,1; EXP@19 1,1; EXP@20 2,1; EXP@21 3,1; EXP@22 -3,0; EXP@23 -2,0; EXP@24 -1,0; EXP@25 0,0; EXP@26 1,0; EXP@27 2,0; EXP@28 3,0; EXP@29 -3,-1; EXP@30 -2,-1; EXP@31 -1,-1; EXP@32 0,-1; EXP@33 1,-1; EXP@34 2,-1; EXP@35 3,-1; EXP@36 -3,-2; EXP@37 -2,-2; EXP@38 -1,-2; EXP@39 0,-2; EXP@40 1,-2; EXP@41 2,-2; EXP@42 3,-2; EXP@43 -3,-3; EXP@44 -2,-3; EXP@45 -1,-3; EXP@46 0,-3; EXP@47 1,-3; EXP@48 2,-3; EXP@49 3,-3
SO16 = smd 0.66 x 2.032: 1 -4.445,-3.073; 2 -3.175,-3.073; 3 -1.905,-3.073; 4 -0.635,-3.073; 5 0.635,-3.073; 6 1.905,-3.073; 7 3.175,-3.073; 8 4.445,-3.073; 9 4.445,3.073; 10 3.175,3.073; 11 1.905,3.073; 12 0.635,3.073; 13 -0.635,3.073; 14 -1.905,3.073; 15 -3.175,3.073; 16 -4.445,3.073
JP1 = drill 0.914 long: 1 0,-1.27; 2 0,1.27
INDUCTOR_PA0513 = smd 3.5 x 6.5: 1 -5.25,0; 2 5.25,0
INDCUCTOR_7.3X7.3 = smd 3 x 3: 1 -3,0; 2 3,0
OSCILLATOR_7X5_SMD = smd 1.8 x 2: 1 -2.54,-2.1; 2 2.54,-2.1; 3 2.54,2.1; 4 -2.54,2.1
HC49UP = smd 5.334 x 1.93: 1 -4.826,0; 2 4.826,0
R0805K = smd 1.3 x 1.6: 1 -1,0; 2 1,0
S64W = drill 0.813 long: A 2.54,1.27; E -2.54,1.27; S 0,1.27
CON-THOMAS-BETTS_RIA_AKL2POL = drill 1.4 pad 2.6 long: 1 -2.54,0; 2 2.54,0
MYSTUFF_USB_MINI-ASSMANN = smd 1.9 x 0.39: 1 8.05,1.6; 2 8.05,0.8; 3 8.05,0; 4 8.05,-0.8; 5 8.05,-1.6 | smd 2.5 x 2: SHD1 2.25,4.45; SHD2 7.75,4.45; SHD3 2.25,-4.45; SHD4 7.75,-4.45 | hole 0.9: 5.25,2.2; 5.25,-2.2
AVR-ISP-6 = drill 1.016 square: 1 -2.54,-1.27 | drill 1.016 octagon: 2 -2.54,1.27; 3 0,-1.27; 4 0,1.27; 5 2.54,-1.27; 6 2.54,1.27

### Placement (x,y rotation side)
C1  39.75,73.25 90 top
C2  23.5,73.25 270 top
C3  26.75,73.25 270 top
C4  30,73.25 270 top
C5  33.25,73.25 270 top
C6  6.5,73.25 270 top
C7  8.5,73.25 270 top
C8  12.5,68.5 90 top
C9  10.5,64.5 90 top
C10  11.5,60.75 0 top
C11  7.5,58.75 180 top
C12  30,65.75 90 top
C13  33.25,65.75 90 top
C14  36.5,65.75 90 top
C15  39.75,65.75 90 top
C16  43,65.75 90 top
C17  2,52.25 90 top
C18  9,46 90 top
C19  16.5,45.5 180 top
C20  21.5,45.5 0 top
C21  2,34 270 top
C22  10,34 90 top
C23  2,40 270 top
C24  10,40 90 top
C25  9,27.5 90 top
C26  92.5,65 270 top
C27  94.5,65 270 top
C28  97.5,47.5 90 top
C29  91.5,40 270 top
C30  97.5,52 270 top
C31  78,55 270 top
C32  78,47 90 top
C33  92,18.5 180 top
C34  29.25,42.75 0 top
C35  29.25,40.75 180 top
C36  29.25,44.75 180 top
C37  54.25,42.75 0 top
C38  54.25,40.75 180 top
C39  54.25,44.75 180 top
C40  29.25,17.75 0 top
C41  29.25,15.75 180 top
C42  29.25,19.75 180 top
C43  54.25,17.75 0 top
C44  54.25,15.75 180 top
C45  54.25,19.75 180 top
C46  35.5,48.25 90 top
C47  39.5,48.25 90 top
C48  35.5,34.75 270 top
C49  39.5,34.75 270 top
C50  60.5,48.25 90 top
C51  64.5,48.25 90 top
C52  60.5,34.75 270 top
C53  64.5,34.75 270 top
C54  35.5,23.25 90 top
C55  39.5,23.25 90 top
C56  35.5,9.75 270 top
C57  39.5,9.75 270 top
C58  60.5,23.25 90 top
C59  64.5,23.25 90 top
C60  60.5,9.75 270 top
C61  64.5,9.75 270 top
D1  46,73.25 270 top
IC1  17,71.5 90 top
IC2  8,50.5 270 top
IC3  6,34 270 top
IC4  6,40 270 top
IC5  89,60.5 180 top
IC6  90.5,51 0 top
IC8  37.5,41.5 0 top
IC9  62.5,41.5 0 top
IC10  37.5,16.5 0 top
IC11  62.5,16.5 0 top
IC12  85.5,14 270 top
JP1  20,32 270 top
JP2  20,36.5 270 top
JP3  20,41 270 top
L1  21,61.5 180 top
L2  19,50.5 0 top
Q1  14,26 0 top
Q2  82,51 90 top
R1  10.5,73.25 90 top
R2  12.5,73.25 90 top
R3  2,67.5 90 top
R4  2,63.5 90 top
R5  10.5,68.5 270 top
R6  7.5,65.5 90 top
R7  12.5,64.5 270 top
R8  11.5,58.75 0 top
R9  4,46 90 top
R10  7,46 270 top
R11  11,46 90 top
R12  13,46 270 top
R13  88.5,65.5 180 top
R14  97.5,57.5 90 top
R15  31.5,53.5 270 top
R16  34,53.5 270 top
R17  36.5,53.5 270 top
R18  39,53.5 270 top
R19  41.5,53.5 270 top
R20  44,53.5 270 top
R21  46.5,53.5 270 top
R22  49,53.5 270 top
R23  51.5,53.5 270 top
R24  54,53.5 270 top
R25  56.5,53.5 270 top
R26  59,53.5 270 top
R27  61.5,53.5 270 top
R28  64,53.5 270 top
R29  66.5,53.5 270 top
R30  69,53.5 270 top
R31  79,13.25 180 top
TP1  13,33.5 180 top
TP2  13,39.5 180 top
TP3  20,27 180 top
TP4  85,27.5 180 top
TP5  78.5,27.5 180 top
X1  55,70 0 top
X2  91,80 270 top
X3  94.3,35.24 0 top

### Tracks (layer width: path | path; a pad name or v marks a point on that pad's centre or on a via)
+0.9V
  Top 0.406: IC3.5 9.95,34.95 C22.2 10.23,34.77 TP1.1 17.23,34.77 18.73,33.27 JP1.1
+1V8
  Top 0.406: IC4.5 9.95,40.95 C24.2 10.23,40.77 TP2.1 17.27,40.77 17.5,41 JP3.1 JP2.1
+3V3  (via drill 0.5)
  Top 0.254: R9.2 v4,47.75 | IC5.7 v92.5,62 | IC5.6 92,61.5 v92.5,62 | R13.2 v86.25,65.5 | v92.5,62 v92.5,62.75 C26.2 C27.2 | IC6.4 87.6,51.4 v88,51 | IC6.6 87.7,49.8 v88,49.5 | R14.2 v97.5,59.75 | C28.2 97.5,49 IC6.18 v90.5,49
  Top 0.406: 3.5,33.05 2.05,33.05 C21.2 | IC4.3 3.5,39.05 | 3.5,39.05 2.05,39.05 C23.2 | IC3.1 3.95,34.95 3.5,34.5 3.5,33.05 | IC4.1 3.95,40.95 3.5,40.5 3.5,39.05 | IC3.3 3.5,33.05 | 3.5,33.05 v3.5,32.25 v3.5,31.25 | 3.5,39.05 v3.5,38.25 v3.5,37.25 | X3.2 91.75,38.74 C29.2 | v11.5,21.25 v11.5,22.25 11.5,23.86 Q1.1 Q1.4 11.06,28.5 C25.2 | C33.2 90.94,18.45 IC12.16 v87,18.45 | R31.2 v76.75,13.25
  Bottom 0.406: v11.5,21.25 v11.5,22.25
  other vias: 19,46.5 19,45.5 19,44.5
  pour Top (isolate 0.25, no thermals): 19.25,53 19.25,47 16.5,47 16.5,44 21.5,44 21.5,47.5 24,47.5 24,53
  pour Route15 (isolate 0.254): 24,53 12,53 12,48 0,48 0,0 100,0 100,67.75 76,67.75 76,3 24,3
+12V  (via drill 0.3, 0.5)
  Top 0.254: C7.1 v8.5,75.25 9,75.75 15.25,75.75 16,75 IC1.19 | R3.2 v2,69.25 | R12.2 13,44 12.75,43.75 2.75,43.75 2,44.5 C17.1
  Top 0.406: 2.25,51 C17.1 2.38,51.13 3.5,51.13 | IC2.VIN 3.5,51.13 | 3.5,51.13 v3.5,51 | 3,50 2.5,50.5 2.5,51 3,51 | v3.5,50 3.5,50.5 | 3.5,50.5 v3.5,51 | v3.5,51 3,51 | 3,51 3,50.5 | 3,50.5 3,50 | 3,50 v3.5,50 | v3.5,50 3,50.5 | 3,50.5 v3.5,51 | 4,51 3.5,50.5
  other vias: 33.25,76 34,76 32.5,76 32.5,76.75 33.25,76.75 34,76.75 30,76 30.75,76 30.75,76.75 30,76.75 29.25,76.75 29.25,76 26.75,76 27.5,76 27.5,76.75 26.75,76.75 26,76.75 26,76 23.5,76 24.25,76 24.25,76.75 23.5,76.75 22.75,76.75 22.75,76 41,77.5 41,76.75 41,76 41,75.25 41,74.5 38.5,74.5 38.5,75.25 38.5,76 38.5,76.75 38.5,77.5 19.5,76 19.5,76.75 18.75,76.75 18,76.75 17.25,76.75 17.25,76 18,76 18.75,76 9.25,75.25 7.75,75.25
  pour Route15 (isolate 0.25, no thermals): 75,68.75 75,80 0,80 0,49 7.5,49 7.5,68.75
  pour Top (isolate 0.25, no thermals): 75,80 75,67 55.5,67 55.5,73.5 0,73.5 0,80
/CS_EN  (via drill 0.5)
  Top 0.254: IC6.14 91.7,43.7 89.25,41.25 v89.25,36 | v89.25,31.75 89.25,27.5 80.75,19 80.75,15.13 81.25,14.63 IC12.4
  Top 0.406: IC12.4 IC12.5 80.11,13.37 R31.1
  Route15 0.254: v89.25,36 v89.25,31.75
A0  (via drill 0.5)
  Top 0.254: IC6.23 v93.5,53 | IC12.1 83.69,18.45 84,18.75 84,20 v88.5,24.5
  Route15 0.254: v93.5,53 93.5,45.5 88.5,40.5 v88.5,24.5
A1  (via drill 0.5)
  Top 0.254: IC6.24 93.25,53.8 92.5,53.05 v92.5,53 | IC12.2 83.67,17.18 84.75,18.25 84.75,19.75 v87.75,22.75
  Route15 0.254: v92.5,53 92.5,45.75 87.75,41 v87.75,22.75
A2  (via drill 0.5)
  Top 0.254: v91.5,53 91.5,53.5 92,54 92.8,54 93.3,54.5 IC6.25 | IC12.3 83.66,15.9 85.5,17.75 85.5,19.5 v87,21
  Route15 0.254: v91.5,53 91.5,46 87,41.5 v87,21
BS  (via drill 0.3, 0.5)
  Top 0.254: IC6.11 89.3,45.05 86.75,42.5 v82.75,42.5 | IC10.13 v30,14.25 | v30,39.25 IC8.13 | IC11.13 v55,14.25 | v55,39.25 IC9.13 | v30,6 v55,6 | v75.5,3.25 v75.5,5.25
  Route15 0.254: v30,39.25 v30,14.25 v30,6 | v55,39.25 v55,14.25 v55,6 68.5,6 71.25,3.25 v75.5,3.25 | v82.75,42.5 82.75,40.25 82,39.5 76,39.5 75.5,39 v75.5,5.25
CORE_LINE_0  (via drill 0.3, 0.5)
  Top 0.254: v10.5,62.75 C9.1
  Route15 0.254: v35.75,62.75 35.75,67.12 35.5,67.38 11.5,67.38 11.25,67.12 11.25,63 11,62.75 v10.5,62.75 | v37.25,62.75 37.25,67.62 36.75,68.12 11,68.12 10.5,67.62 10.5,66 10,65.5 R6.S
  Bottom 0.254: R6.E R6.S
  other vias: 30,62.75 30.75,62.75 29.25,62.75 29.25,62 29.25,61.25 30,61.25 30,62 30.75,62 30.75,61.25 33.25,62.75 34,62.75 32.5,62.75 32.5,62 32.5,61.25 33.25,61.25 33.25,62 34,62 34,61.25 35.75,62 35.75,61.25 36.5,61.25 36.5,62 37.25,62 37.25,61.25 39.75,62.75 40.5,62.75 39,62.75 39,62 39,61.25 39.75,61.25 39.75,62 40.5,62 40.5,61.25 43,62.75 43.75,62.75 42.25,62.75 42.25,62 42.25,61.25 43,61.25 43,62 43.75,62 43.75,61.25 31.5,55.5 34,55.5 36.5,55.5 39,55.5 41.5,55.5 44,55.5 46.5,55.5 49,55.5 51.5,55.5 54,55.5 56.5,55.5 59,55.5 61.5,55.5 64,55.5 66.5,55.5 69,55.5 32.75,55.5 35.25,55.5 37.75,55.5 40.25,55.5 42.75,55.5 45.25,55.5 47.75,55.5 50.25,55.5 52.75,55.5 55.25,55.5 57.75,55.5 60.25,55.5 62.75,55.5 65.25,55.5 67.75,55.5
  pour Route15 (isolate 0.25): 12,54 12,66.75 35,66.75 35,62 38,62 38,67.75 75,67.75 75,54
  pour Top (isolate 0.25, no thermals): 21.25,65.5 75,65.5 75,54 21.25,54
CS0  (via drill 0.3, 0.5)
  Top 0.254: IC8.39 v46,40.75 | v86.75,17.18 IC12.15
  Route15 0.254: v46,40.75 46,2 46.25,1.75 46.75,1.75 47,2 85.25,2 86.75,3.5 v86.75,17.18
CS1  (via drill 0.3, 0.5)
  Top 0.254: IC9.39 v71,40.75 | v85.25,15.9 IC12.14
  Route15 0.254: v71,40.75 71,4.25 71.25,4 84.5,4 85.25,4.75 v85.25,15.9
CS2  (via drill 0.3, 0.5)
  Top 0.254: IC10.39 v47,15.75 | v86,14.63 IC12.13
  Route15 0.254: v47,15.75 47,2.75 47.25,2.5 84.75,2.5 86,3.75 v86,14.63
CS3  (via drill 0.3, 0.5)
  Top 0.254: IC11.39 v72,15.75 | v84.5,13.37 IC12.12
  Route15 0.254: v72,15.75 72,4.75 72.25,4.5 84,4.5 84.5,5 v84.5,13.37
EN  (via drill 0.3)
  Top 0.254: IC1.2 15,67 14.75,66.75 v14,66.75 | R4.2 v2,65.5 R3.1
  Bottom 0.254: v14,66.75 2.25,66.75 R3.1 v2,65.5
GND  (via drill 0.3, 0.5)
  Top 0.254: 7.75,71.5 7.75,71.75 | 7.75,72 7.75,72.25 | 7.75,72.5 7.75,72.75 | 7.75,72.75 7.75,73 21.25,73 21.25,72.75 | 21.25,72.25 21.25,72.5 | 21.25,71.75 21.25,72 | 21.25,71.25 21.25,71.5 | 21.25,70.75 21.25,71 | 21.25,70.25 21.25,70.5 | 21.25,70.25 21.25,70 14,70 14,70.25 | 21.25,71 14,71 | 21.25,71 21.25,71.25 | 21.25,71.25 14,71.25 | 14,71.25 7.75,71.25 7.75,71.5 | 21.25,71.5 v12.5,71.5 | v12.5,71.5 v10.5,71.5 | v10.5,71.5 7.75,71.5 | 21.25,71.5 21.25,71.75 | 21.25,71.75 7.75,71.75 | 7.75,71.75 7.75,72 | 21.25,72 7.75,72 | 21.25,72 21.25,72.25 | 21.25,72.25 R2.1 | R2.1 R1.1 | R1.1 C7.2 7.75,72.25 | 7.75,72.25 7.75,72.5 | 21.25,72.5 7.75,72.5 | 21.25,72.5 21.25,72.75 | 21.25,72.75 7.75,72.75 | 14,70.5 14,70.75 | 14,70.75 14,71 | 21.25,70.75 14.55,70.75 | 14.55,70.75 14,70.75 | 21.25,70.5 21.25,70.75 | 21.25,70.5 14,70.5 | 14,70.25 14,70.5 | 21.25,70.25 14,70.25 | 14,70.75 10.75,70.75 10.5,70.5 R5.1 | 14.55,70.75 IC1.GND@1 | 14,71 14,71.25 | C11.2 v5.75,58.75 | R4.1 v2,61.75 | v89.5,60 IC5.3 92.5,60 | IC8.7 34.5,42.25 IC8.EXP@15 | IC8.9 34.5,41.25 IC8.EXP@22 | IC8.11 34.5,40.25 IC8.EXP@29 | IC9.7 59.5,42.25 IC9.EXP@15 | IC9.9 59.5,41.25 IC9.EXP@22 | IC9.11 59.5,40.25 IC9.EXP@29 | IC10.7 34.5,17.25 IC10.EXP@15 | IC10.9 34.5,16.25 IC10.EXP@22 | IC10.11 34.5,15.25 IC10.EXP@29 | IC11.7 59.5,17.25 IC11.EXP@15 | IC11.9 59.5,16.25 IC11.EXP@22 | IC11.11 59.5,15.25 IC11.EXP@29 | C42.2 v27.75,19.75 | C40.1 v27.75,17.75 | C41.2 v27.75,15.75 | C45.2 v52.75,19.75 | C43.1 v52.75,17.75 | C44.2 v52.75,15.75 | C35.2 v27.75,40.75 | C34.1 v27.75,42.75 | C36.2 v27.75,44.75 | C39.2 v52.75,44.75 | C37.1 v52.75,42.75 | C38.2 v52.75,40.75 | C46.2 v35.5,50 | C47.2 v39.5,50 | C50.2 v60.5,50 | C51.2 v64.5,50 | C52.2 v60.5,33
  Top 0.254: C53.2 v64.5,33 | C48.2 v35.5,33 | C49.2 v39.5,33 | C54.2 v35.5,25 | C55.2 v39.5,25 | C58.2 v60.5,25 | C59.2 v64.5,25 | C56.2 v35.5,8 | C57.2 v39.5,8 | C60.2 v60.5,8 | C61.2 v64.5,8 | v6.5,71.5 C6.2 | v10.5,71.5 R1.1 | v12.5,71.5 R2.1
  Top 0.406: IC4.2 v6,40 | v6,40 v6,41 | v6,40 v6,39 | IC3.2 v6,34 | v6,34 v6,35 | v6,34 v6,33 | C23.1 v2,42.25 v2,43.25 | C21.1 v2,36.25 v2,37.25 | C22.1 v10,31.75 v10,30.75 | C24.1 v10,37.75 v10,36.75 | C25.1 v9,25.25 v9,24.25 | v89.5,60 IC5.EXP
  other vias: 43,70.25 43,69.5 42.25,69.5 42.25,70.25 43.75,70.25 43.75,69.5 43.75,68.75 43,68.75 42.25,68.75 36.5,70.25 36.5,69.5 35.75,69.5 35.75,70.25 37.25,70.25 37.25,69.5 37.25,68.75 36.5,68.75 35.75,68.75 33.25,70.25 33.25,69.5 32.5,69.5 32.5,70.25 34,70.25 34,69.5 34,68.75 33.25,68.75 32.5,68.75 30,70.25 30,69.5 29.25,69.5 29.25,70.25 30.75,70.25 30.75,69.5 30.75,68.75 30,68.75 29.25,68.75 26.75,70.25 26.75,69.5 26,69.5 26,70.25 27.5,70.25 27.5,69.5 27.5,68.75 26.75,68.75 26,68.75 23.5,70.25 23.5,69.5 22.75,69.5 22.75,70.25 24.25,70.25 24.25,69.5 24.25,68.75 23.5,68.75 22.75,68.75 38.25,68.75 38.25,69.5 38.25,70.25 41.25,68.75 41.25,69.5 41.25,70.25 8.5,71.5 2.5,55.5 15,44 23,44 15,43 7.5,52.5 8.5,52.5 7.5,51.5 8.5,51.5 7.5,50.5 8.5,50.5 1.5,55.5 88.5,60 89.5,61 88.5,61 96.5,66 96.5,65 96.5,64 86.5,70 95.5,70 85.5,70 96.5,70 78,52.5 78,49.5 97.5,54.25 90.5,51 90.5,52 90.5,50 97.5,45.25 18.52,23.86 18.52,22.59 91.5,42.25 94.25,18.5 80.5,9.5 79.5,9.5
  pour Route2 (isolate 0.25, no thermals): 0,0 0,80 100,80 100,0
  pour Bottom (isolate 0.25, no thermals): 0,0 0,80 100,80 100,0
  pour Top (isolate 0.25, no thermals): 54.5,66 21.25,66 21.25,70 14,70 14,71.25 5.75,71.25 5.75,73 54.5,73
  pour Top (isolate 0.25, no thermals): 8.75,51.75 3.25,51.75 3.25,50.75 0,50.75 0,53 8.75,53
  pour Top (isolate 0.25, rank 6): 0,80 100,80 100,0 0,0
HARD0  (via drill 0.3, 0.5)
  Top 0.254: IC6.12 90.1,44.6 87.25,41.75 v76.5,41.75 | IC8.43 v44,42.75 | IC10.43 v44,17.75 | IC9.43 v69,42.75 | IC11.43 v69,17.75 | v44,4.5 56,4.5 58,6.5 v69,6.5
  Route15 0.254: v44,42.75 v44,17.75 v44,4.5 | v69,6.5 v69,17.75 v69,42.75 75.5,42.75 v76.5,41.75
HARD1  (via drill 0.3, 0.5)
  Top 0.254: IC6.13 90.9,44.15 87.75,41 v78.25,41 | IC8.44 v43.5,43.25 | IC10.44 v43.5,18.25 | IC9.44 v68.5,43.25 | IC11.44 v68.5,18.25 | v68.5,7 57.75,7 55.75,5 v43.5,5
  Route15 0.254: v43.5,43.25 v43.5,18.25 v43.5,5 | v68.5,7 v68.5,18.25 v68.5,43.25 76,43.25 v78.25,41
MISO_3.3V  (via drill 0.3)
  Top 0.254: IC6.16 93.3,45.2 95.56,42.94 95.56,35.88 94.93,35.24 93.66,35.24 92.39,33.97 X3.1 78.47,33.97 75,30.5 v70,30.5 | IC8.41 v45,41.75 | IC10.41 v45,16.75 | IC9.41 v70,41.75 | IC11.41 v70,16.75 | v45,3.5 56.5,3.5 58.5,5.5 v70,5.5
  Route15 0.254: v45,41.75 v45,16.75 v45,3.5 | v70,41.75 v70,30.5 v70,16.75 v70,5.5
MOSI_3.3V  (via drill 0.3)
  Top 0.254: IC6.15 92.5,45 94.3,43.2 X3.4 93.66,36.51 92.39,35.24 78.49,35.24 74.5,31.25 v69.5,31.25 | IC8.42 v44.5,42.25 | IC10.42 v44.5,17.25 | IC9.42 v69.5,42.25 | IC11.42 v69.5,17.25 | v69.5,6 58.25,6 56.25,4 v44.5,4
  Route15 0.254: v44.5,42.25 v44.5,17.25 v44.5,4 | v69.5,42.25 v69.5,31.25 v69.5,17.25 v69.5,6
N$1
  Top 0.406: 14.75,63.5 R7.2 | 14.75,60.75 C10.2 | 14.75,58.75 R8.2
  pour Top (isolate 0.25, no thermals): 20.75,58 20.75,69.5 14,69.5 14,58
N$3
  Top 0.406: R8.1 C11.1
N$4
  Top 0.254: C8.1 R7.1 C9.2
N$6  (via drill 0.5)
  Top 0.254: IC6.29 90.1,56.1 90.5,56.5 R14.1 v97.5,55.25 | X3.5 96.83,9 96.33,8.5 86,8.5 85.5,9 85.5,11.6 85,12.1 IC12.6
  Bottom 0.254: X3.5 98,33.97 98.5,34.47 98.5,54.75 98,55.25 v97.5,55.25
N$8
  Top 0.254: IC1.21 15,74.5 14.75,74.75 13,74.75 R2.2
N$9
  Top 0.254: IC1.20 15.5,74.75 15,75.25 10.75,75.25 10.5,75 R1.2
N$10
  Top 0.254: IC1.18 16.5,75.25 15.5,76.25 7.25,76.25 6.5,75.5 C6.1
N$14  (via drill 0.3)
  Top 0.254: IC1.4 16,66.75 15.25,66 v14,66 | v9.75,60.75 C10.1
  Bottom 0.254: v14,66 14,61.25 13.5,60.75 v9.75,60.75
N$18
  Top 0.254: R11.1 C18.1
N$21
  pour Top (isolate 0.25, no thermals): 18.75,47.5 18.75,53 9.5,53 9.5,50.5 14.25,50.5 14.25,47.5
N$23
  Top 0.254: 5.5,45 R10.2 | 5.5,45 R9.1 | IC2.FB 5.5,48.59 5.5,45
N$24
  Top 0.254: R11.2 11,48.59 IC2.COMP
N$25
  Top 0.254: R12.1 13,49.37 12.5,49.87 IC2.EN
N$26
  Top 0.254: IC6.20 97.5,50.6 C30.2
N$30
  Top 0.254: IC6.7 84,49 82,51 Q2.2 78.17,55.83 C31.1
N$32
  Top 0.254: IC5.9 90,65.5 R13.1
N$34
  Top 0.254: IC6.8 82,48.2 Q2.1 78.17,46.17 C32.1
N$35  (via drill 0.5)
  Top 0.254: IC5.4 94,60.5 94.5,61 v94.5,62 | X2.3 v91,70
  Bottom 0.254: v94.5,62 94.5,68 92.5,70 v91,70
N$36  (via drill 0.5)
  Top 0.254: IC5.5 93,61 v93.5,61.5 | v91.8,69.2 X2.2
  Bottom 0.254: v93.5,61.5 93.5,67.5 v91.8,69.2
N$38
  Top 0.254: IC5.8 90.5,63.5 91,64 91,67 92.6,68.6 X2.1
OSC_CLK  (via drill 0.3)
  Top 0.254: TP3.1 16.54,28.27 Q1.3 | IC10.12 v30.5,14.75 | v30.5,39.75 IC8.12 | IC11.12 v55.5,14.75 | v55.5,39.75 IC9.12 | v30.5,6.5 v55.5,6.5
  Route15 0.254: v55.5,39.75 v55.5,14.75 v55.5,6.5 | v30.5,6.5 v30.5,14.75 v30.5,39.75 29.5,39.75 29.25,39.5 29.25,28.75 28.75,28.25 20.02,28.25 TP3.1
PLLAHVDD  (via drill 0.3)
  Top 0.254: IC10.6 v31.5,17.75 C40.2 | IC8.6 v31.5,42.75 C34.2 | IC11.6 v56.5,17.75 C43.2 | IC9.6 v56.5,42.75 C37.2 | v31.5,7.5 v56.5,7.5
  Route15 0.254: 31.5,41.5 v31.5,17.75 v31.5,7.5 | 31.5,41.5 31.5,42 | 31.5,42 v31.5,42.75 | v56.5,42.75 v56.5,17.75 v56.5,7.5 | JP3.2 26.75,41 27.5,41.75 31.25,41.75 | 31.25,41.75 31.5,42 | 31.25,41.75 31.5,41.5
PLLDVDD  (via drill 0.3)
  Top 0.254: IC10.10 v31,15.75 | v31,15.75 31,16.5 31.25,16.75 IC10.8 | IC8.10 v31,40.75 | v31,40.75 31,41.5 31.25,41.75 IC8.8 | IC11.10 v56,15.75 | v56,15.75 56,16.5 56.25,16.75 IC11.8 | IC9.10 v56,40.75 | v56,40.75 56,41.5 56.25,41.75 IC9.8 | v31,7 v56,7 | v31,15.75 C41.1 | v56,15.75 C44.1 | v56,40.75 C38.1 | v31,40.75 C35.1
  Route15 0.254: v56,40.75 v56,15.75 v56,7 | v31,7 v31,15.75 v31,40.75 29,40.75 28.5,40.25 28.5,32.5 28,32 JP1.2
RESET  (via drill 0.3, 0.5)
  Top 0.254: IC8.38 v46.5,40.25 | IC10.38 v46.5,15.25 | IC9.38 v71.5,40.25 | IC11.38 v71.5,15.25 | v46.5,2.5 57,2.5 59,4.5 v71.5,4.5 | IC6.28 90.9,53.4 v90.5,53
  Route15 0.254: v46.5,40.25 v46.5,15.25 v46.5,2.5 | v71.5,4.5 v71.5,15.25 v71.5,40.25 81.5,40.25 82,40.75 82,52.5 82.5,53 v90.5,53
RXD
  Top 0.254: IC5.25 89,57 88.5,56.5 IC6.31
SCK_3.3V  (via drill 0.3)
  Top 0.254: IC6.17 94.5,48.2 94.5,45.2 98.11,41.59 98.11,35.88 97.47,35.24 96.2,35.24 94.93,33.97 X3.3 93.03,32.7 78.45,32.7 75.5,29.75 v70.5,29.75 | IC8.40 v45.5,41.25 | IC10.40 v45.5,16.25 | IC9.40 v70.5,41.25 | IC11.40 v70.5,16.25 | v70.5,5 58.75,5 56.75,3 v45.5,3
  Route15 0.254: v45.5,41.25 v45.5,16.25 v45.5,3 | v70.5,41.25 v70.5,29.75 v70.5,16.25 v70.5,5
TXD
  Top 0.254: IC6.30 89.3,56.3 89.5,56.5 IC5.26
VDD_CORE  (via drill 0.3, 0.5)
  Top 0.406: TP5.1 74.5,28.77 74.5,28.5
  other vias: 31.5,51.5 34,51.5 36.5,51.5 39,51.5 41.5,51.5 44,51.5 46.5,51.5 49,51.5 51.5,51.5 54,51.5 56.5,51.5 59,51.5 61.5,51.5 64,51.5 66.5,51.5 69,51.5 60.25,51.5 57.75,51.5 55.25,51.5 52.75,51.5 50.25,51.5 47.75,51.5 45.25,51.5 42.75,51.5 40.25,51.5 37.75,51.5 35.25,51.5 32.75,51.5 62.75,51.5 65.25,51.5 67.75,51.5 50,29 49,29 50,30 51,29 50,28 49,28 49,30 51,30 51,28 50,27 50,31 52,29 48,27 52,31 52,27 48,31 48,29 48,30 49,31 51,31 52,30 52,28 51,27 49,27 48,28 62.75,23 62.75,24 62.75,25 61.75,23 61.75,24 61.75,25 37.75,23 36.75,23 36.75,24 36.75,25 37.75,25 37.75,24 37.75,48 37.75,49 37.75,50 36.75,50 36.75,49 36.75,48 62.75,48 61.75,48 61.75,49 61.75,50 62.75,50 62.75,49 37.75,10 37.75,9 37.75,8 36.75,8 36.75,9 36.75,10 62.75,10 62.75,9 62.75,8 61.75,8 61.75,9 61.75,10 37.75,35 36.75,35 36.75,34 37.75,34 37.75,33 36.75,33 62.75,35 62.75,34 62.75,33 61.75,33 61.75,34 61.75,35 33.75,10 33.75,9 33.75,8 41.25,10 41.25,9 41.25,8 32.75,10 32.75,9 32.75,8 42.25,10 42.25,9 42.25,8 33.75,23 32.75,23 41.25,23 42.25,23 33.75,24 33.75,25 32.75,25 32.75,24 41.25,24 41.25,25 42.25,24 42.25,25 58.75,10 58.75,9 58.75,8 57.75,10 57.75,9 57.75,8 66.25,10 67.25,10 66.25,9 67.25,9 66.25,8 67.25,8 67.25,25 67.25,24 67.25,23 66.25,25 66.25,24 66.25,23 58.75,25 58.75,24 58.75,23 57.75,25 57.75,24 57.75,23 32.75,50 33.75,50 32.75,49 33.75,49 32.75,48 33.75,48 41.25,50 42.25,50 41.25,48 41.25,49 42.25,49 42.25,48 57.75,50 58.75,50 57.75,49 58.75,49 57.75,48 58.75,48 66.25,50 67.25,50 66.25,49 67.25,49 66.25,48 67.25,48 32.75,35 33.75,35 32.75,34 33.75,34 32.75,33 33.75,33 57.75,35 58.75,35 57.75,34 58.75,34 57.75,33 58.75,33 66.25,35 67.25,35 66.25,34 67.25,34 66.25,33 67.25,33 41.25,35 42.25,35 41.25,34 42.25,34 41.25,33 42.25,33
  pour Route15 (isolate 0.25, no thermals): 25,4 75,4 75,53 25,53
  pour Top (isolate 0.25, no thermals): 25,0 75,0 75,53 25,53
VDD_IO  (via drill 0.3)
  Top 0.254: IC10.56 v37.75,22 | v37.75,11 IC10.25 | IC10.5 v32,18.25 31.25,18.25 31,18.5 31,19.5 30.75,19.75 C42.1 | IC10.37 v43,14.75 | IC8.5 v32,43.25 31.25,43.25 31,43.5 31,44.5 30.75,44.75 C36.1 | v37.75,47 IC8.56 | IC8.37 v43,39.75 | IC8.25 v37.75,36 | v62.75,22 IC11.56 | IC11.37 v68,14.75 | IC11.25 v62.75,11 | v62.75,47 IC9.56 | IC9.37 v68,39.75 | IC9.25 v62.75,36 | IC11.5 v57,18.25 56.25,18.25 56,18.5 56,19.5 55.75,19.75 C45.1 | IC9.5 v57,43.25 56.25,43.25 56,43.5 56,44.5 55.75,44.75 C39.1 | v68,7.5 57.5,7.5 55.5,5.5 v43,5.5
  Route15 0.254: v37.75,22 37.75,20.75 37.25,20.25 34.25,20.25 33.75,19.75 33.75,18.25 | 37.75,12.75 v37.75,11 | v32,18.25 33.75,18.25 | 33.75,43.25 v32,43.25 31.25,43.25 31,43.5 27.5,43.5 27,43 20.5,43 20,42.5 20,37.77 JP2.2 | v37.75,47 37.75,45.75 37.25,45.25 34.25,45.25 33.75,44.75 33.75,43.25 | v37.75,36 37.75,37.75 | v62.75,22 62.75,20.75 62.25,20.25 59.25,20.25 58.75,19.75 58.75,18.25 | v62.75,11 62.75,12.75 | v62.75,47 62.75,45.75 62.25,45.25 59.25,45.25 58.75,44.75 58.75,43.25 | v62.75,36 62.75,37.75 | 43,37.75 v43,14.75 43,12.75 | 43,37.75 v43,39.75 | v68,39.75 68,37.75 | 68,37.75 v68,14.75 68,12.75 | 37.75,37.75 43,37.75 | 33.75,43.25 33.75,38.25 34.25,37.75 37.75,37.75 | 62.75,37.75 68,37.75 | 62.75,37.75 59.25,37.75 58.75,38.25 58.75,43.25 | 37.75,12.75 34.25,12.75 33.75,13.25 33.75,18.25 | 37.75,12.75 43,12.75 | 62.75,12.75 68,12.75 | 62.75,12.75 59.25,12.75 58.75,13.25 58.75,18.25 | v57,18.25 58.75,18.25 | v57,43.25 58.75,43.25 | 43,12.75 v43,5.5 | 68,12.75 v68,7.5
VFB
  Top 0.254: IC1.1 14.5,69.25 12.5,69.25 C8.2 R5.2 9,67.5 8.46,68.04 R6.A

### Text on the board
tNames: TP | AVDD | 1.8V | GND | TP | IOVDD | TP | 0.9V | DVDD | GND | TP | TP | TP | TP | CLK | coreV | 3.3V | TP | GND | TP | GND | TP | GND | BE200 QUAD | Rev. 1.00